# Altium project PROC010B.PrjPcb (part 1 of 5)
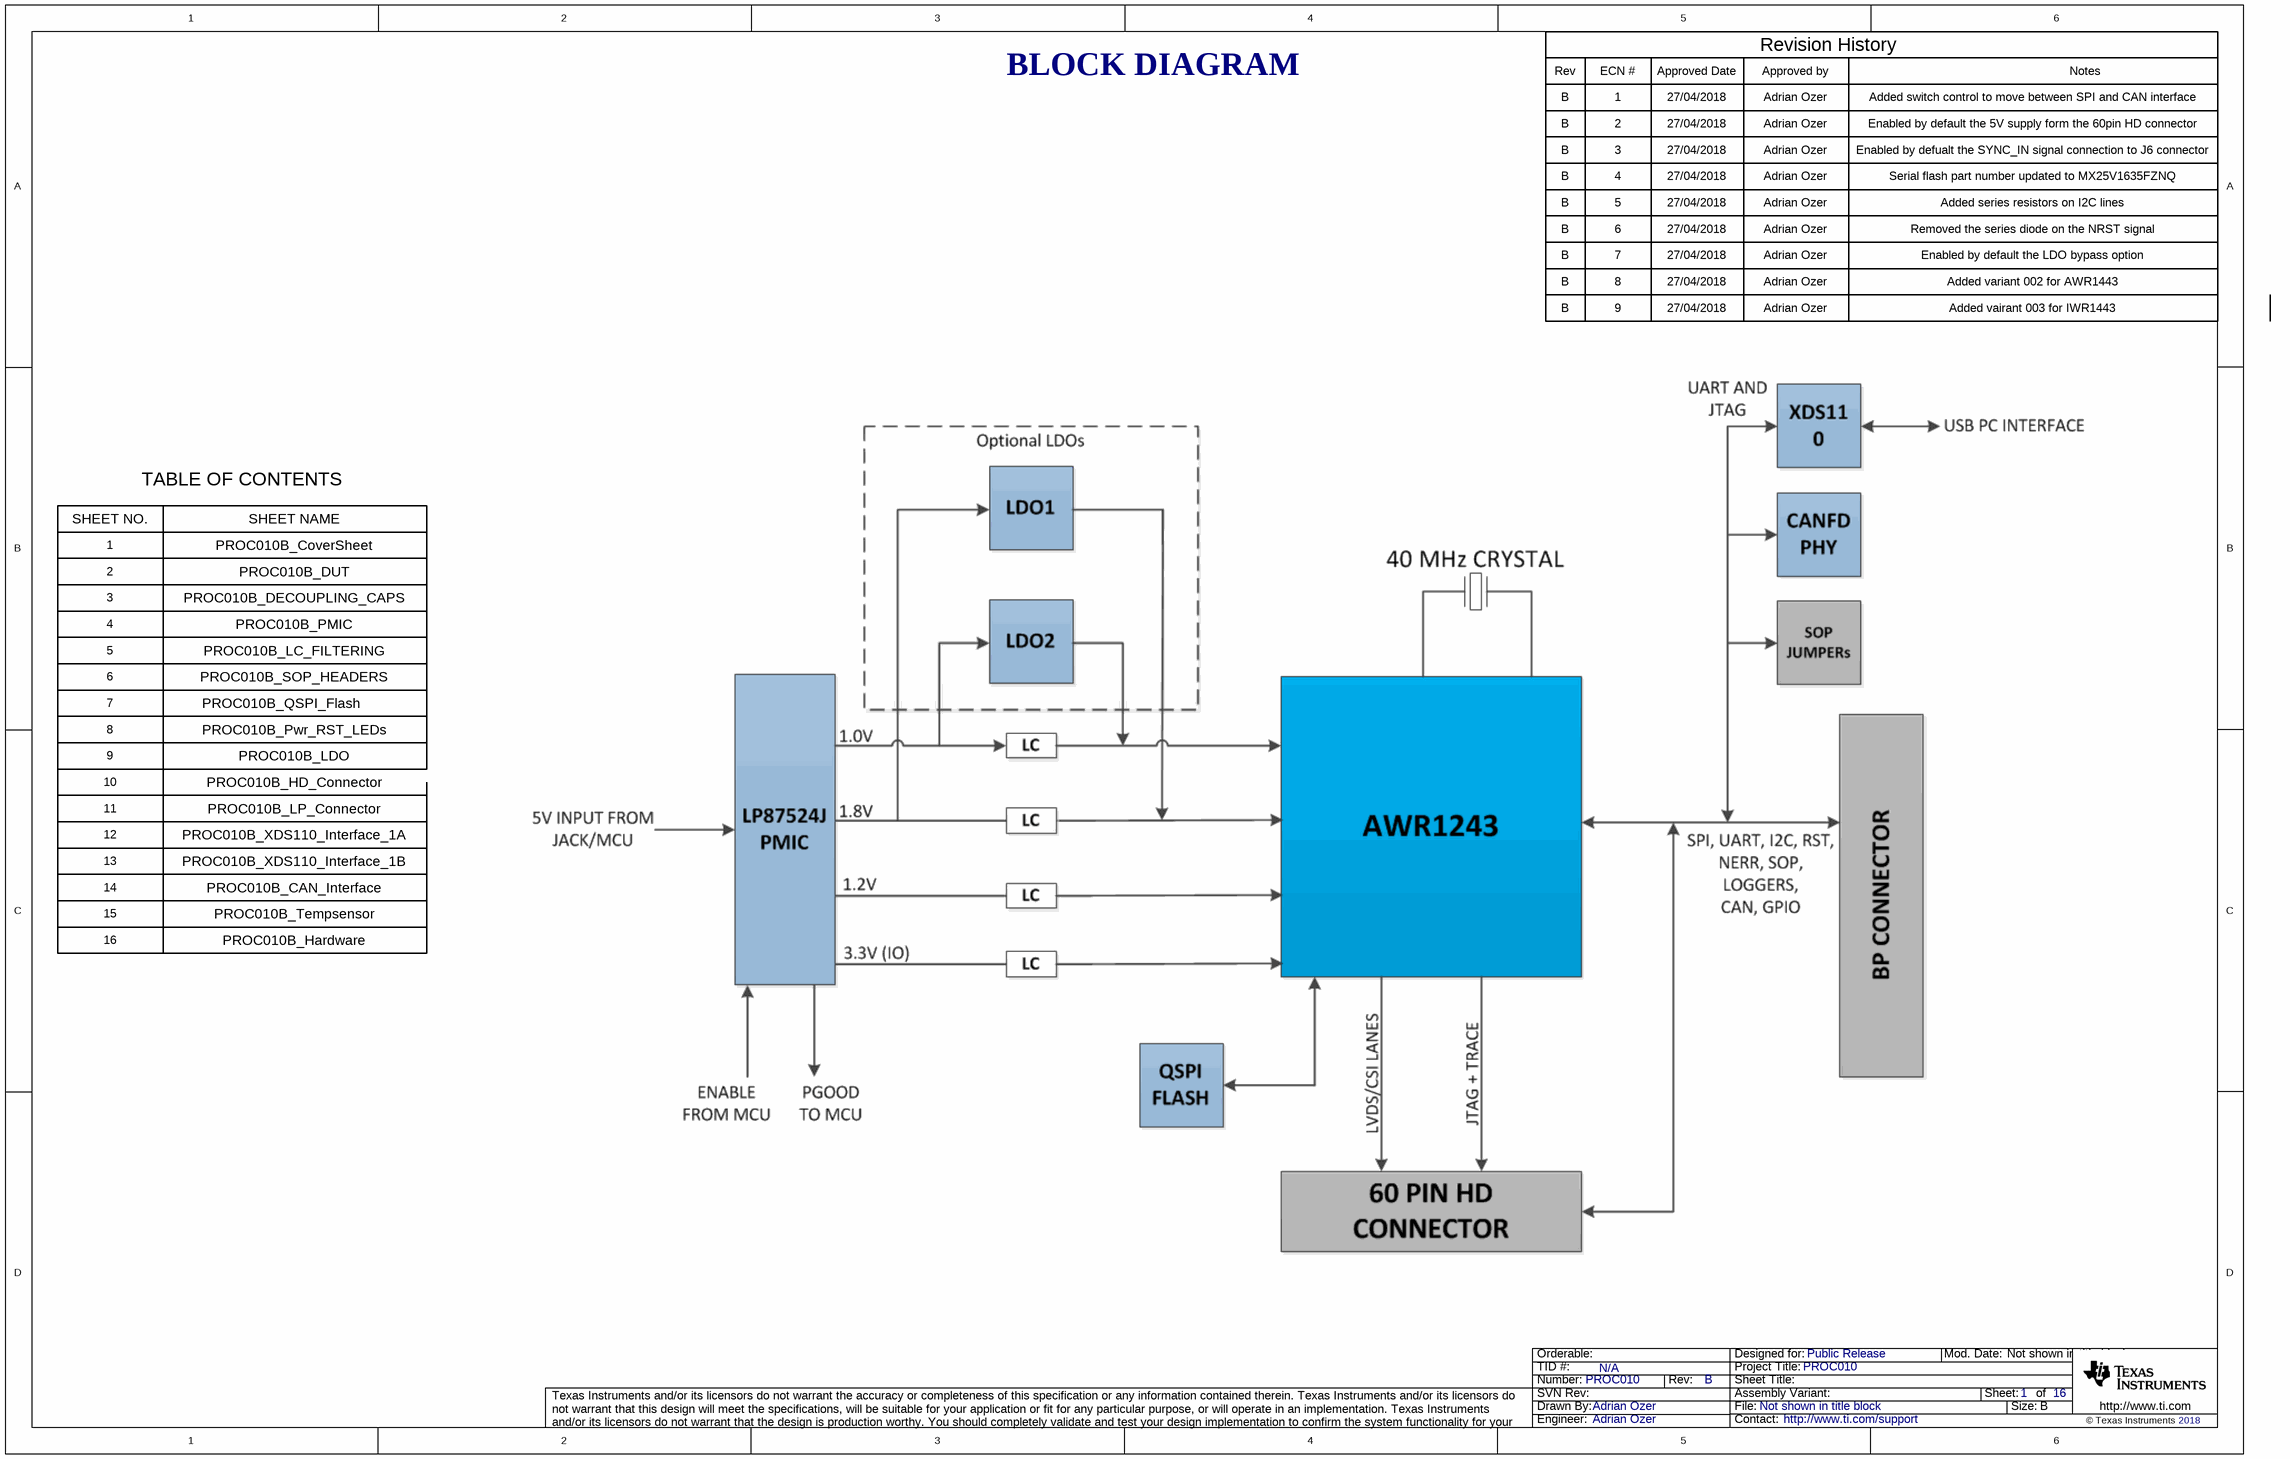
[diagram p0: PROC010B_CoverSheet.SchDoc]
CopyrightYear: 2018; PCB_Layout: Tessolve; PCB_Rev: B; PRJ_Customer: Public Release; PRJ_Engineer: Adrian Ozer; PRJ_Number: PROC010; PRJ_Title: PROC010; SCH_Rev: B; TechSupport: http://www.ti.com/support; TID: N/A
16 sheets, 385 parts. Net scope: flat (ports and power ports of the same name join across sheets).
Board file: PROC010B_PCB.PcbDoc
Sheets:
  PROC010B_CoverSheet.SchDoc
  PROC010B_DUT_Reference.SchDoc
  PROC010B_Decoupling_Caps_Reference.SchDoc
  PROC010B_PMIC_Reference.SchDoc
  PROC010B_LC_Filtering_Reference.SchDoc
  PROC010B_SOP_Headers_Reference.SchDoc
  PROC010B_QSPI_Flash_Reference.SchDoc
  PROC010B_Pwr_RST_LEDs.SchDoc
  PROC010B_LDO.SchDoc
  PROC010B_HD Connector.SchDoc
  PROC010B_LP Connector.SchDoc
  PROC010B_XDS110 Interface_1A.SchDoc
  PROC010B_XDS110 Interface_1B.SchDoc
  PROC010B_CAN Interface.SchDoc
  PROC010B_Tempsensor.SchDoc
  PROC010B_Hardware.SchDoc

## Sheet PROC010B_CoverSheet.SchDoc
size 431 x 279 mm; Date: Not shown in title block; ApprovedBy: Not shown in title block; CheckedBy: Not shown in title block; Author: Not shown in title block; CompanyName: Not shown in title block; DrawnBy: Adrian Ozer; Engineer: Not shown in title block; Organization: Not shown in title block; Address1: Not shown in title block; Address2: Not shown in title block; Address3: Not shown in title block; Address4: Not shown in title block; DocumentNumber: 1; Revision: Use project parameter SCH_Rev; SheetNumber: 1; SheetTotal: 16; PageSetup: Record=PageOptions|CenterHorizontal=True|CenterVertical=True|PrintScale=1.00|XCorrection=1.00|YCorrection=1.00|PrintKind=0|BorderSize=5000000|LeftOffset=0|BottomOffset=0|Orientation=2|PaperLength=1000|PaperWidth=1000|Scale=100|PaperSource=15|PrintQuality=600|MediaType=1|DitherType=10|PaperKind=Letter|PrintScaleMode=1; CurrentTime: Not shown in title block; CurrentDate: Not shown in title block; Time: Not shown in title block; DocumentFullPathAndName: Not shown in title block; DocumentName: Not shown in title block; ModifiedDate: Not shown in title block; ImagePath: Not shown in title block

### Notes on the sheet
- BLOCK DIAGRAM
- Rev
- B
- ECN #
- 1
- Approved Date
- 27/04/2018
- Approved by
- Adrian Ozer
- Revision History
- Added switch control to move between SPI and CAN interface
- Notes
- 2
- 3
- Enabled by default the 5V supply form the 60pin HD connector
- Enabled by defualt the SYNC_IN signal connection to J6 connector
- 4
- 5
- 6
- Serial flash part number updated to MX25V1635FZNQ
- Added series resistors on I2C lines
- Removed the series diode on the NRST signal
- 7
- 8
- Enabled by default the LDO bypass option
- Added variant 002 for AWR1443
- 9
- Added vairant 003 for IWR1443
- TABLE OF CONTENTS
- SHEET NO.
- SHEET NAME
- PROC010B_CoverSheet
- PROC010B_DUT
- PROC010B_DECOUPLING_CAPS
- PROC010B_PMIC
- PROC010B_LC_FILTERING
- PROC010B_SOP_HEADERS
- PROC010B_QSPI_Flash
- PROC010B_Pwr_RST_LEDs
- PROC010B_LDO
- 11
- 10
- PROC010B_HD_Connector
- PROC010B_LP_Connector
- 12
- 13
- 14
- PROC010B_XDS110_Interface_1A
- PROC010B_XDS110_Interface_1B
- PROC010B_CAN_Interface
- 15
- 16
- PROC010B_Tempsensor
- PROC010B_Hardware
- Drawn By:
- SVN Rev:
- Number:
- TID #:
- Orderable:
- Rev:
- Sheet Title:
- File:
- Project Title:
- Designed for:
- Assembly Variant:
- Mod. Date:
- Sheet:
- Size:
- of
- http://www.ti.com
- Texas Instruments and/or its licensors do not warrant the accuracy or completeness of this specification or any information contained therein. Texas Instruments and/or its licensors do not warrant that this design will meet the specifications, will be suitable for your application or fit for any particular purpose, or will operate in an implementation. Texas Instruments and/or its licensors do not warrant that the design is production worthy. You should completely validate and test your design implementation to confirm the system functionality for your application.
- Engineer:
- Contact:
- © Texas Instruments

## Sheet PROC010B_DUT_Reference.SchDoc
size 431 x 279 mm; Date: Not shown in title block; ApprovedBy: Not shown in title block; CheckedBy: Not shown in title block; Author: Not shown in title block; CompanyName: Not shown in title block; DrawnBy: Adrian Ozer; Engineer: Not shown in title block; Organization: Not shown in title block; Address1: Not shown in title block; Address2: Not shown in title block; Address3: Not shown in title block; Address4: Not shown in title block; DocumentNumber: 2; Revision: Use project parameter SCH_Rev; SheetNumber: 2; SheetTotal: 16; PageSetup: Record=PageOptions|CenterHorizontal=True|CenterVertical=True|PrintScale=1.00|XCorrection=1.00|YCorrection=1.00|PrintKind=0|BorderSize=5000000|LeftOffset=0|BottomOffset=0|Orientation=2|PaperLength=1000|PaperWidth=1000|Scale=100|PaperSource=15|PrintQuality=600|MediaType=1|DitherType=10|PaperKind=Letter|PrintScaleMode=1; CurrentTime: Not shown in title block; CurrentDate: Not shown in title block; Time: Not shown in title block; DocumentFullPathAndName: Not shown in title block; DocumentName: Not shown in title block; ModifiedDate: Not shown in title block; ImagePath: Not shown in title block
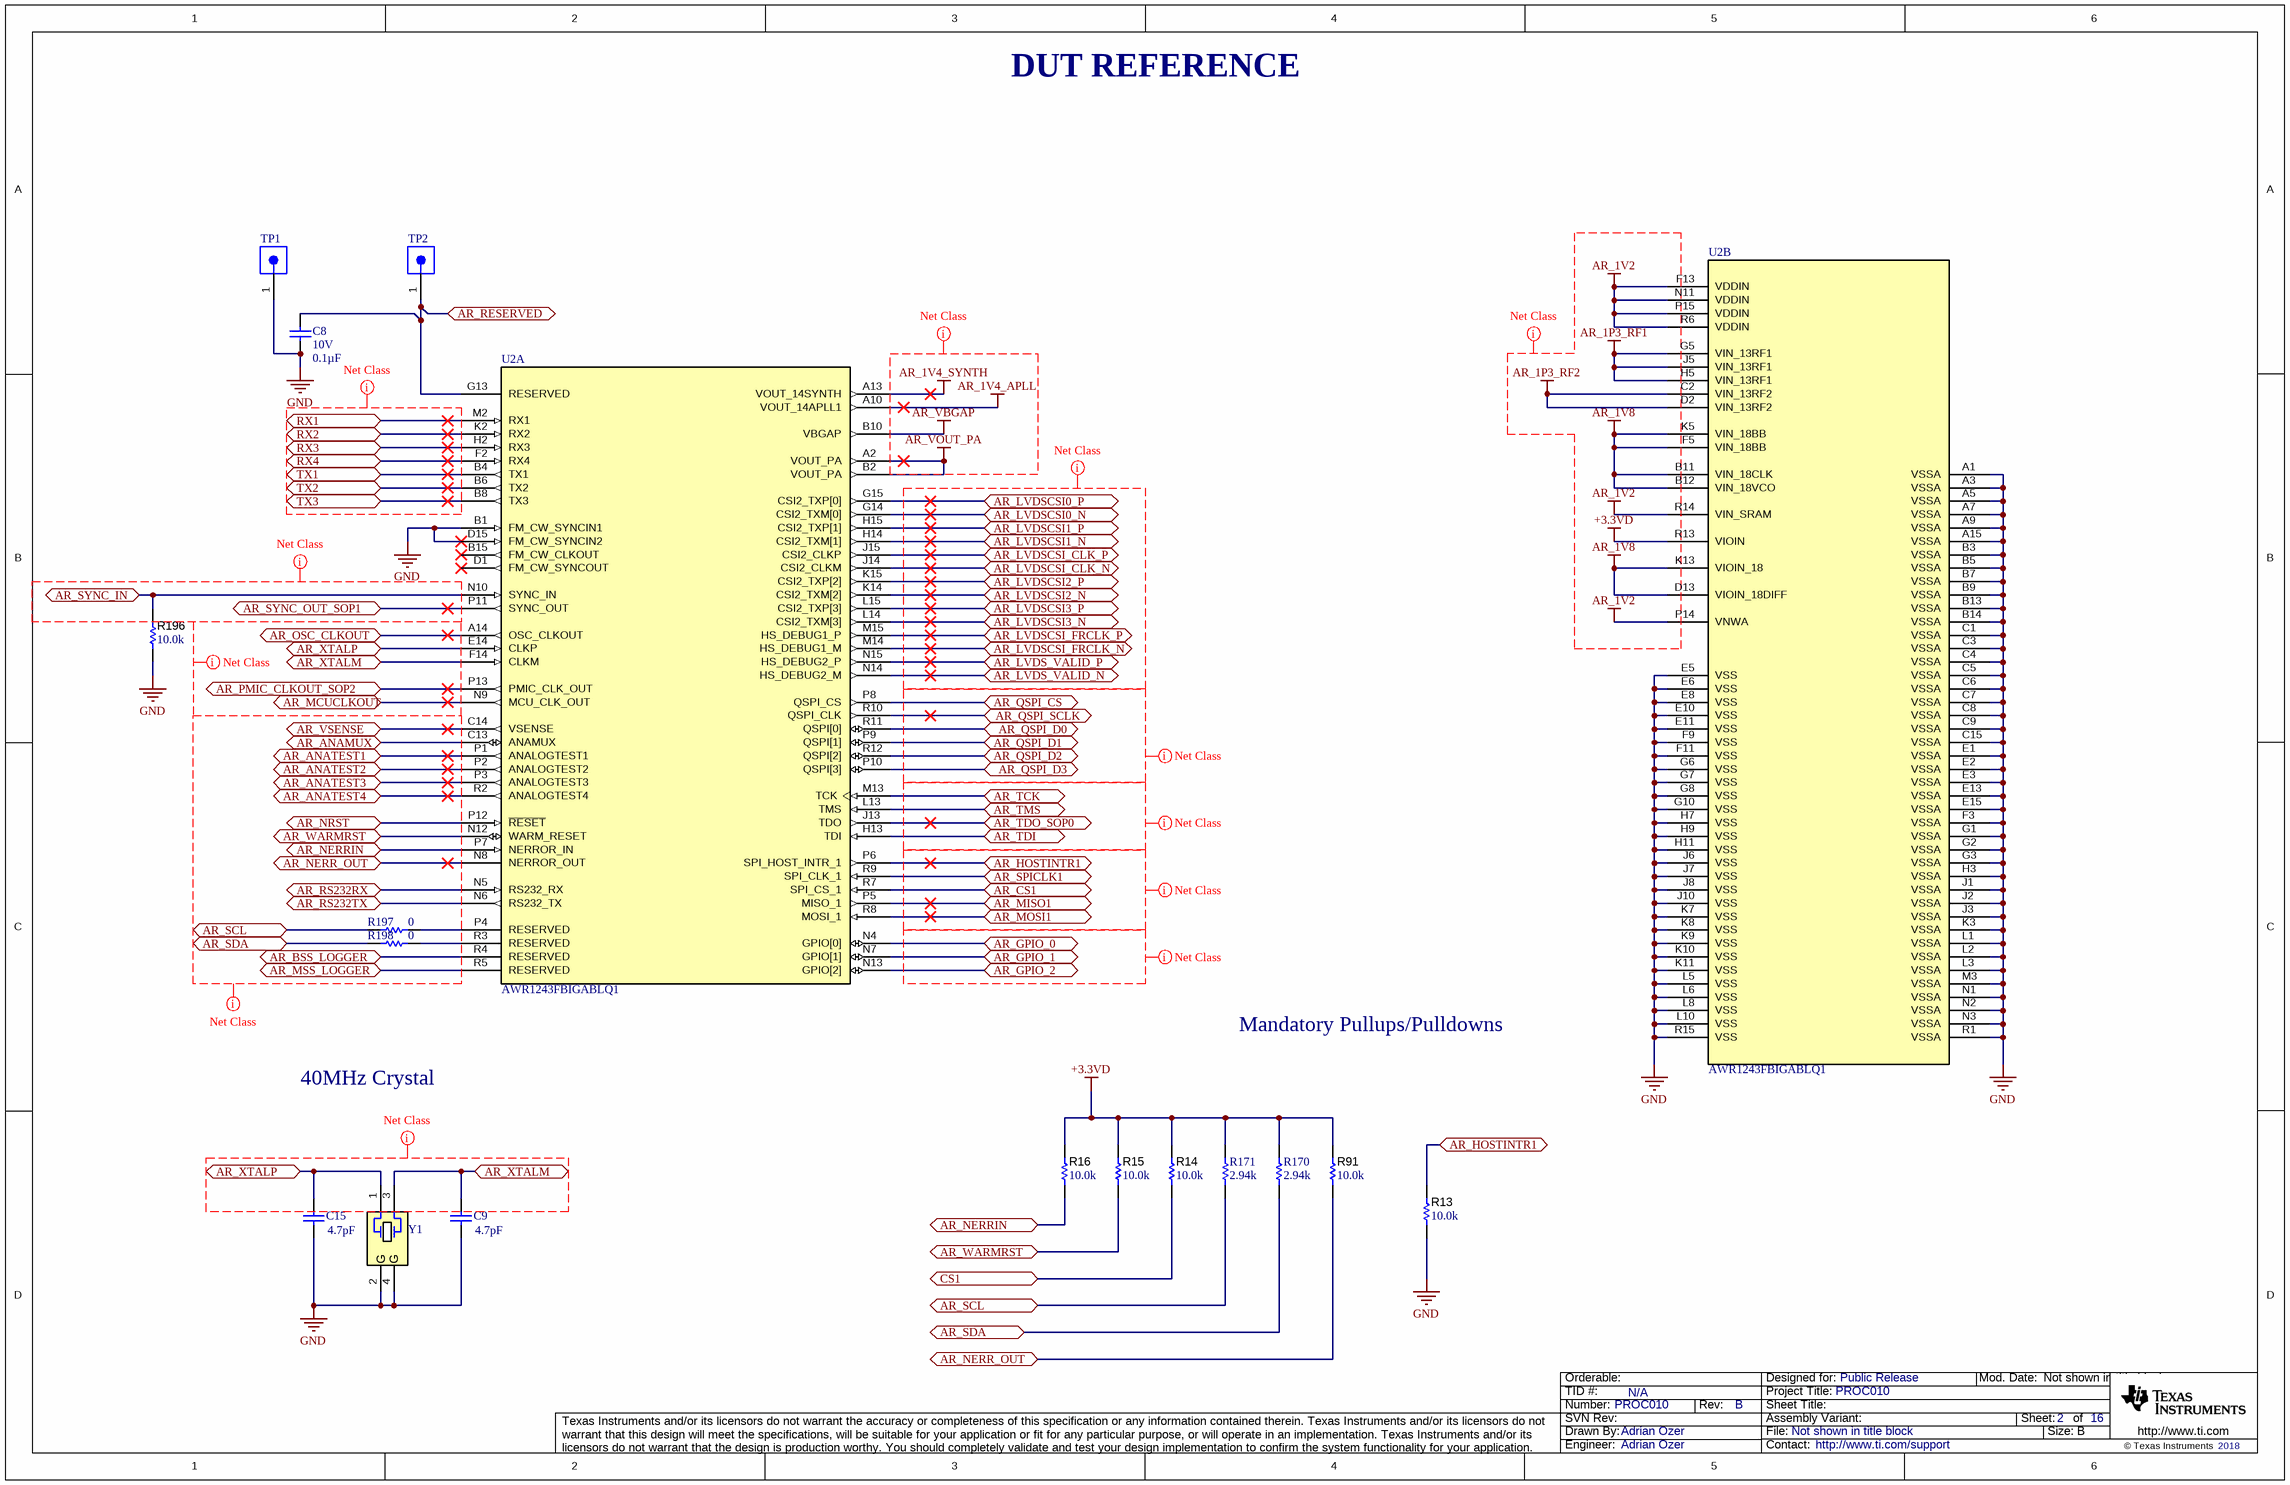
[diagram p1: PROC010B_DUT_Reference.SchDoc]

### Parts
C8  VDC_V: 10V  ValueDisplayed: 0.1µF  [0201_033]  (hidden comment: C0603X7S1A104K030BC)
C9  ValueDisplayed: 4.7pF  [0402]  (hidden comment: GJM1555C1H4R7BB01D)
C15  ValueDisplayed: 4.7pF  [0402]  (hidden comment: GJM1555C1H4R7BB01D)
R13  ValueDisplayed: 10.0k  [0402L]  (hidden comment: CRCW040210K0FKED)
R14  ValueDisplayed: 10.0k  [0402L]  (hidden comment: CRCW040210K0FKED)
R15  ValueDisplayed: 10.0k  [0402L]  (hidden comment: CRCW040210K0FKED)
R16  ValueDisplayed: 10.0k  [0402L]  (hidden comment: CRCW040210K0FKED)
R91  ValueDisplayed: 10.0k  [0402L]  (hidden comment: CRCW040210K0FKED)
R170  ValueDisplayed: 2.94k  [0402]  (hidden comment: CRCW04022K94FKED)
R171  ValueDisplayed: 2.94k  [0402]  (hidden comment: CRCW04022K94FKED)
R196  ValueDisplayed: 10.0k  [0402L]  (hidden comment: CRCW040210K0FKED)
R197  ValueDisplayed: 0  [0201]  (hidden comment: CRCW02010000Z0ED)
R198  ValueDisplayed: 0  [0201]  (hidden comment: CRCW02010000Z0ED)
TP1  TSW-101-17-T-S  [Samtec_TSW-101-17-T-S]  (value not drawn)
TP2  TSW-101-17-T-S  [Samtec_TSW-101-17-T-S]  (value not drawn)
U2  AWR1243FBIGABLQ1  [ABL0161A]  (parts A,B of 2)
Y1  CX3225SA40000D0PTWCC  [Kyocera_CX3225SA]  (value not drawn)

### Ports
AR_ANAMUX, AR_ANATEST1, AR_ANATEST2, AR_ANATEST3, AR_ANATEST4, AR_BSS_LOGGER, AR_CS1, AR_GPIO_0, AR_GPIO_1, AR_GPIO_2, AR_HOSTINTR1, AR_LVDS_VALID_N, AR_LVDS_VALID_P, AR_LVDSCSI0_N, AR_LVDSCSI0_P, AR_LVDSCSI1_N, AR_LVDSCSI1_P, AR_LVDSCSI2_N, AR_LVDSCSI2_P, AR_LVDSCSI3_N, AR_LVDSCSI3_P, AR_LVDSCSI_CLK_N, AR_LVDSCSI_CLK_P, AR_LVDSCSI_FRCLK_N, AR_LVDSCSI_FRCLK_P, AR_MCUCLKOUT, AR_MISO1, AR_MOSI1, AR_MSS_LOGGER, AR_NERR_OUT, AR_NERRIN, AR_NRST, AR_OSC_CLKOUT, AR_PMIC_CLKOUT_SOP2, AR_QSPI_CS, AR_QSPI_D0, AR_QSPI_D1, AR_QSPI_D2, AR_QSPI_D3, AR_QSPI_SCLK, AR_RESERVED, AR_RS232RX, AR_RS232TX, AR_SCL, AR_SDA, AR_SPICLK1, AR_SYNC_IN, AR_SYNC_OUT_SOP1, AR_TCK, AR_TDI, AR_TDO_SOP0, AR_TMS, AR_VSENSE, AR_WARMRST, AR_XTALM, AR_XTALP, CS1, RX1, RX2, RX3, RX4, TX1, TX2, TX3

### Nets
+3.3VD: R14.2 R15.2 R16.2 R91.2 R170.2 R171.2 U2.R13(VIOIN)
AR_1P3_RF1: U2.G5(VIN_13RF1) U2.H5(VIN_13RF1) U2.J5(VIN_13RF1)
AR_1P3_RF2: U2.C2(VIN_13RF2) U2.D2(VIN_13RF2)
AR_1V2: U2.F13(VDDIN) U2.N11(VDDIN) U2.P14(VNWA) U2.P15(VDDIN) U2.R6(VDDIN) U2.R14(VIN_SRAM)
AR_1V4_APLL: U2.A10(VOUT_14APLL1)
AR_1V4_SYNTH: U2.A13(VOUT_14SYNTH)
AR_1V8: U2.B11(VIN_18CLK) U2.B12(VIN_18VCO) U2.D13(VIOIN_18DIFF) U2.F5(VIN_18BB) U2.K5(VIN_18BB) U2.K13(VIOIN_18)
AR_VBGAP: U2.B10(VBGAP)
AR_VOUT_PA: U2.A2(VOUT_PA) U2.B2(VOUT_PA)
GND: C8.2 C9.2 C15.1 R13.1 R196.1 TP1.1 U2.A1(VSSA) U2.A3(VSSA) U2.A5(VSSA) U2.A7(VSSA) U2.A9(VSSA) U2.A15(VSSA) U2.B1(FM_CW_SYNCIN1) U2.B3(VSSA) U2.B5(VSSA) U2.B7(VSSA) U2.B9(VSSA) U2.B13(VSSA) U2.B14(VSSA) U2.C1(VSSA) U2.C3(VSSA) U2.C4(VSSA) U2.C5(VSSA) U2.C6(VSSA) U2.C7(VSSA) U2.C8(VSSA) U2.C9(VSSA) U2.C15(VSSA) U2.D15(FM_CW_SYNCIN2) U2.E1(VSSA) U2.E2(VSSA) U2.E3(VSSA) U2.E5(VSS) U2.E6(VSS) U2.E8(VSS) U2.E10(VSS) U2.E11(VSS) U2.E13(VSSA) U2.E15(VSSA) U2.F3(VSSA) U2.F9(VSS) U2.F11(VSS) U2.G1(VSSA) U2.G2(VSSA) U2.G3(VSSA) U2.G6(VSS) U2.G7(VSS) U2.G8(VSS) U2.G10(VSS) U2.H3(VSSA) U2.H7(VSS) U2.H9(VSS) U2.H11(VSS) U2.J1(VSSA) U2.J2(VSSA) U2.J3(VSSA) U2.J6(VSS) U2.J7(VSS) U2.J8(VSS) U2.J10(VSS) U2.K3(VSSA) U2.K7(VSS) U2.K8(VSS) U2.K9(VSS) U2.K10(VSS) U2.K11(VSS) U2.L1(VSSA) U2.L2(VSSA) U2.L3(VSSA) U2.L5(VSS) U2.L6(VSS) U2.L8(VSS) U2.L10(VSS) U2.M3(VSSA) U2.N1(VSSA) U2.N2(VSSA) U2.N3(VSSA) U2.R1(VSSA) U2.R15(VSS) Y1.2(GND) Y1.4(GND)
AR_ANAMUX: U2.C13(ANAMUX) ; port AR_ANAMUX
AR_ANATEST1: U2.P1(ANALOGTEST1) ; port AR_ANATEST1
AR_ANATEST2: U2.P2(ANALOGTEST2) ; port AR_ANATEST2
AR_ANATEST3: U2.P3(ANALOGTEST3) ; port AR_ANATEST3
AR_ANATEST4: U2.R2(ANALOGTEST4) ; port AR_ANATEST4
AR_BSS_LOGGER: U2.R4(RESERVED) ; port AR_BSS_LOGGER
AR_CS1: U2.R7(SPI_CS_1) ; port AR_CS1
AR_GPIO_0: U2.N4(GPIO[0]) ; port AR_GPIO_0
AR_GPIO_1: U2.N7(GPIO[1]) ; port AR_GPIO_1
AR_GPIO_2: U2.N13(GPIO[2]) ; port AR_GPIO_2
AR_HOSTINTR1: R13.2 U2.P6(SPI_HOST_INTR_1) ; port AR_HOSTINTR1
AR_LVDS_VALID_N: U2.N14(HS_DEBUG2_M) ; port AR_LVDS_VALID_N
AR_LVDS_VALID_P: U2.N15(HS_DEBUG2_P) ; port AR_LVDS_VALID_P
AR_LVDSCSI0_N: U2.G14(CSI2_TXM[0]) ; port AR_LVDSCSI0_N
AR_LVDSCSI0_P: U2.G15(CSI2_TXP[0]) ; port AR_LVDSCSI0_P
AR_LVDSCSI1_N: U2.H14(CSI2_TXM[1]) ; port AR_LVDSCSI1_N
AR_LVDSCSI1_P: U2.H15(CSI2_TXP[1]) ; port AR_LVDSCSI1_P
AR_LVDSCSI2_N: U2.K14(CSI2_TXM[2]) ; port AR_LVDSCSI2_N
AR_LVDSCSI2_P: U2.K15(CSI2_TXP[2]) ; port AR_LVDSCSI2_P
AR_LVDSCSI3_N: U2.L14(CSI2_TXM[3]) ; port AR_LVDSCSI3_N
AR_LVDSCSI3_P: U2.L15(CSI2_TXP[3]) ; port AR_LVDSCSI3_P
AR_LVDSCSI_CLK_N: U2.J14(CSI2_CLKM) ; port AR_LVDSCSI_CLK_N
AR_LVDSCSI_CLK_P: U2.J15(CSI2_CLKP) ; port AR_LVDSCSI_CLK_P
AR_LVDSCSI_FRCLK_N: U2.M14(HS_DEBUG1_M) ; port AR_LVDSCSI_FRCLK_N
AR_LVDSCSI_FRCLK_P: U2.M15(HS_DEBUG1_P) ; port AR_LVDSCSI_FRCLK_P
AR_MCUCLKOUT: U2.N9(MCU_CLK_OUT) ; port AR_MCUCLKOUT
AR_MISO1: U2.P5(MISO_1) ; port AR_MISO1
AR_MOSI1: U2.R8(MOSI_1) ; port AR_MOSI1
AR_MSS_LOGGER: U2.R5(RESERVED) ; port AR_MSS_LOGGER
AR_NERR_OUT: R91.1 U2.N8(NERROR_OUT) ; port AR_NERR_OUT
AR_NERRIN: R16.1 U2.P7(NERROR_IN) ; port AR_NERRIN
AR_NRST: U2.P12(~{RESET}) ; port AR_NRST
AR_OSC_CLKOUT: U2.A14(OSC_CLKOUT) ; port AR_OSC_CLKOUT
AR_PMIC_CLKOUT_SOP2: U2.P13(PMIC_CLK_OUT) ; port AR_PMIC_CLKOUT_SOP2
AR_QSPI_CS: U2.P8(QSPI_CS) ; port AR_QSPI_CS
AR_QSPI_D0: U2.R11(QSPI[0]) ; port AR_QSPI_D0
AR_QSPI_D1: U2.P9(QSPI[1]) ; port AR_QSPI_D1
AR_QSPI_D2: U2.R12(QSPI[2]) ; port AR_QSPI_D2
AR_QSPI_D3: U2.P10(QSPI[3]) ; port AR_QSPI_D3
AR_QSPI_SCLK: U2.R10(QSPI_CLK) ; port AR_QSPI_SCLK
AR_RESERVED: C8.1 TP2.1 U2.G13(RESERVED) ; port AR_RESERVED
AR_RS232RX: U2.N5(RS232_RX) ; port AR_RS232RX
AR_RS232TX: U2.N6(RS232_TX) ; port AR_RS232TX
AR_SCL: R171.1 R197.1 ; port AR_SCL
AR_SDA: R170.1 R198.1 ; port AR_SDA
AR_SPICLK1: U2.R9(SPI_CLK_1) ; port AR_SPICLK1
AR_SYNC_IN: R196.2 U2.N10(SYNC_IN) ; port AR_SYNC_IN
AR_SYNC_OUT_SOP1: U2.P11(SYNC_OUT) ; port AR_SYNC_OUT_SOP1
AR_TCK: U2.M13(TCK) ; port AR_TCK
AR_TDI: U2.H13(TDI) ; port AR_TDI
AR_TDO_SOP0: U2.J13(TDO) ; port AR_TDO_SOP0
AR_TMS: U2.L13(TMS) ; port AR_TMS
AR_VSENSE: U2.C14(VSENSE) ; port AR_VSENSE
AR_WARMRST: R15.1 U2.N12(WARM_RESET) ; port AR_WARMRST
AR_XTALM: C9.1 U2.F14(CLKM) Y1.3 ; port AR_XTALM
AR_XTALP: C15.2 U2.E14(CLKP) Y1.1 ; port AR_XTALP
CS1: R14.1 ; port CS1
RX1: U2.M2(RX1) ; port RX1
RX2: U2.K2(RX2) ; port RX2
RX3: U2.H2(RX3) ; port RX3
RX4: U2.F2(RX4) ; port RX4
TX1: U2.B4(TX1) ; port TX1
TX2: U2.B6(TX2) ; port TX2
TX3: U2.B8(TX3) ; port TX3
NetR197_2: R197.2 U2.P4(RESERVED)
NetR198_2: R198.2 U2.R3(RESERVED)

Not connected (* = marked no-connect by the designer): U2 B15(FM_CW_CLKOUT)* D1(FM_CW_SYNCOUT)*

### Layout directives
net class RF: (no net found under the mark)
net class GENERAL: (no net found under the mark)
net class SPI: (no net found under the mark)
net class PWR: +3.3VD, AR_1P3_RF1, AR_1P3_RF2, AR_1V2, AR_1V4_APLL, AR_1V4_SYNTH, AR_1V8, AR_VBGAP, AR_VOUT_PA
net class CLK: (no net found under the mark)
net class LVDS: (no net found under the mark)
net class QSPI: (no net found under the mark)
net class JTAG: (no net found under the mark)

### Notes on the sheet
- DUT REFERENCE
- Mandatory Pullups/Pulldowns
- 40MHz Crystal
- Drawn By:
- SVN Rev:
- Number:
- TID #:
- Orderable:
- Rev:
- Sheet Title:
- File:
- Project Title:
- Designed for:
- Assembly Variant:
- Mod. Date:
- Sheet:
- Size:
- of
- B
- http://www.ti.com
- Texas Instruments and/or its licensors do not warrant the accuracy or completeness of this specification or any information contained therein. Texas Instruments and/or its licensors do not warrant that this design will meet the specifications, will be suitable for your application or fit for any particular purpose, or will operate in an implementation. Texas Instruments and/or its licensors do not warrant that the design is production worthy. You should completely validate and test your design implementation to confirm the system functionality for your application.
- Engineer:
- Contact:
- © Texas Instruments
- (in symbol CMP-0004694-3) G

### Library data of the parts
C8 = CMP-0078219-1: CAP, CERM, 0.1 µF, 10 V,+/- 10%, X7S, 0201; Manufacturer: TDK; TaMin_C: -55°C; Polarized: N; Green_Lifecycle: NRND; SizeAreaWB_mm2: 2.08; Green_REACh: Passed; U/M: EA; Value: 0.1uF; TaMax_C: 125°C; SizeZ_mm: 0.33; SizeX_mm: 0.6; SizeY_mm: 0.3; Cap_Case: 0201; SizeArea_mm2: 0.18; Cap_F: 100nF; AEC Category: Q200; ComponentLink1URL: https://product.tdk.com/info/en/catalog/datasheets/mlcc_commercial_general_en.pdf; Supplier Part Number 2: 94Y9906; Supplier 2: Newark; Supplier Part Number 3: 810-C0603X7S1A104K; TempCo: X7S; Supplier 3: Mouser; RoHS: Y; MountType: SMT; Green_EU RoHS-2: Passed; Supplier 1: Digi-Key; Green_EU RoHS: Passed; PackageReference: 0201; Tolerance_%: 10%; Value2: 10V; CompType: Capacitor; PartNumber: C0603X7S1A104K030BC; AEC Qualified: N; ComponentLink1Description: Datasheet link; AEC Grade: N/A; Supplier Part Number 1: 445-9051-1-ND; Technology: Ceramic
C9 C15 = CMP-0006367-2: CAP, CERM, 4.7 pF, 50 V, +/- 2%, C0G/NP0, 0402; Manufacturer: MuRata; TaMin_C: -55°C; Polarized: N; SizeAreaWB_mm2: 3; Value1: Unknown; U/M: EA; Value: 4.7pF; TaMax_C: 125°C; SizeZ_mm: 0.6; SizeX_mm: 1; SizeY_mm: 0.5; Value2: 50V; CompType: Capacitor; AEC Category: Q200; Supplier Part Number 2: 81-GJM1555C1H4R7BB01; Publisher: Texas Instruments; Supplier 2: Mouser; TempCo: C0G/NP0; Published: 2008-06-19; RoHS: Y; MountType: SMT; Supplier 1: Digi-Key; PackageReference: 0402; Tolerance_%: 2%; Cap_Case: 0402; SizeArea_mm2: 0.5; LatestRevisionDate: 2017-03-09; PartNumber: GJM1555C1H4R7BB01D; AEC Qualified: N; Cap_F: 4.7pF; VDC_V: 50V; ComponentLink1Description: Datasheet link; AEC Grade: N/A; Supplier Part Number 1: 490-8102-1-ND; Technology: Ceramic; ComponentLink1URL: http://psearch.murata.com/capacitor/product/GJM1555C1H4R7BB01%23.pdf
R13-R16 R91 = CMP-0025958-3: RES, 10.0 k, 1%, 0.063 W, AEC-Q200 Grade 0, 0402; Manufacturer: Vishay-Dale; Power_W: 63mW; TempCo: 100 ppm/C; Value_Code: 10k0; Value: 10.0k; EIA_Code: E96; Res_ohm: 10k; SizeX_mm: 1; SizeY_mm: 0.5; SizeZ_mm: 0.6; Value2: 0.063W; AEC Qualified: Y; VDC_V: 50V; AEC Category: Q200; AEC Grade: 0; Supplier Part Number 2: 52K6595; Supplier 2: Newark; Supplier Part Number 3: 71-CRCW0402-10K-E3; Supplier 3: Mouser; RoHS: E; Value1: 1%; MountType: SMT; Supplier 1: Digi-Key; PackageReference: 0402; Tolerance_%: 1%; SizeArea_mm2: 0.5; CompType: Resistor; PartNumber: CRCW040210K0FKED; ComponentLink1Description: Datasheet link; Supplier Part Number 1: 541-10.0KLCT-ND; Technology: Thick Film; ComponentLink1URL: http://www.vishay.com/docs/20035/dcrcwe3.pdf
R170 R171 = CMP-0026244-2: RES, 2.94 k, 1%, 0.063 W, AEC-Q200 Grade 0, 0402; Manufacturer: Vishay-Dale; Power_W: 63mW; TempCo: 100 ppm/C; Value_Code: 2k94; Value: 2.94k; EIA_Code: E96; SizeX_mm: 1; SizeY_mm: 0.5; SizeZ_mm: 0.6; Value2: 0.063W; AEC Qualified: Y; VDC_V: 50V; AEC Category: Q200; AEC Grade: 0; ComponentLink1URL: http://www.vishay.com/docs/20035/dcrcwe3.pdf; Supplier Part Number 2: 52K6814; Supplier 2: Newark; Supplier Part Number 3: 71-CRCW0402-2.94K-E3; Supplier 3: Mouser; RoHS: E; Value1: 1%; MountType: SMT; Supplier 1: Digi-Key; PackageReference: 0402; Tolerance_%: 1%; Res_ohm: 2.94k; SizeArea_mm2: 0.5; CompType: Resistor; PartNumber: CRCW04022K94FKED; ComponentLink1Description: Datasheet link; Supplier Part Number 1: 541-2.94KLCT-ND; Technology: Thick Film
R196 = CMP-0025958-3: RES, 10.0 k, 1%, 0.063 W, AEC-Q200 Grade 0, 0402; Manufacturer: Vishay-Dale; Power_W: 63mW; TempCo: 100 ppm/C; Value_Code: 10k0; Value: 10.0k; EIA_Code: E96; Res_ohm: 10k; SizeX_mm: 1; SizeY_mm: 0.5; SizeZ_mm: 0.6; Value2: 0.063W; CompType: Resistor; AEC Qualified: Y; VDC_V: 50V; AEC Category: Q200; AEC Grade: 0; Supplier Part Number 2: 52K6595; Supplier 2: Newark; Supplier Part Number 3: 71-CRCW0402-10K-E3; Supplier 3: Mouser; RoHS: E; Value1: 1%; MountType: SMT; Supplier 1: Digi-Key; PackageReference: 0402; Tolerance_%: 1%; SizeArea_mm2: 0.5; PartNumber: CRCW040210K0FKED; ComponentLink1Description: Datasheet link; Supplier Part Number 1: 541-10.0KLCT-ND; Technology: Thick Film; ComponentLink1URL: http://www.vishay.com/docs/20035/dcrcwe3.pdf
R197 R198 = CMP-0027008-4: RES, 0, 5%, 0.05 W, 0201; Manufacturer: Vishay-Dale; Power_W: 50mW; TempCo: ppm/C; Value_Code: 0000; Value: 0; EIA_Code: E24; SizeX_mm: 0.6; SizeY_mm: 0.3; SizeZ_mm: 0.26; Value2: 0.05W; SizeArea_mm2: 0.18; AEC Qualified: N; AEC Category: Q200; RoHS: E; Value1: 5%; MountType: SMT; Supplier 1: Newark; PackageReference: 0201; Tolerance_%: 5%; Res_ohm: 0; CompType: Resistor; PartNumber: CRCW02010000Z0ED; ComponentLink1Description: Datasheet link; AEC Grade: N/A; Supplier Part Number 1: 72M6743; Technology: Thick Film; ComponentLink1URL: http://www.vishay.com/docs/20052/crcw0201e3.pdf
TP1 TP2 = CMP-0055993-1: Header, 100mil, 1x1, Tin, TH; Manufacturer: Samtec; Cert_VDE: N; CNHeader: FALSE; Current_A: 6.3A; Green_Lifecycle: Active; Gender: Male; Cert_CSA: Y; Green_REACh: Passed; Voltage_V: 550V; Row_Count: 1; Pitch_mm: 2.54; ComponentLink1URL: http://www.samtec.com/documents/webfiles/cpdf/TSW-XXX-XX-XXX-X-XX-XXX-MKT.pdf; Supplier Part Number 2: 12P1227; Publisher: Texas Instruments; Supplier 2: Newark; Shrouded: N; Supplier Part Number 3: 2038061; Color: Black; Supplier 3: Farnell; Cert_CULUS: N; RoHS: Y; MountType: TH; Green_EU RoHS-2: Passed; Supplier 1: Digi-Key; Green_EU RoHS: Passed; PackageReference: 2.54mm Header; PinCount: 1; CompType: Header; LatestRevisionDate: 26/05/2017; PartNumber: TSW-101-17-T-S; Orientation: Vertical; ComponentLink1Description: Datasheet URL; Supplier Part Number 1: SAM1067-01-ND; ContactFinish: Tin; CT: FALSE; Cert_UL: Y
U2 = CMP-0081285-1: Single Chip 77 and 79 GHz FMCW Transceiver, ABL0161A (FCBGA-161); Alternate PartNumber: AWR1243FBIGABLRQ1; Alternate Manufacturer: Texas Instruments; SizeAreaWB_mm2: 153.76; SizeZ_mm: 1.17; SizeX_mm: 10.4; SizeArea_mm2: 108.16; CompType: IC; AEC Qualified: N; AEC Category: Q200; ComponentLink1URL: http://www.ti.com/lit/ds/symlink/awr1243.pdf; PackageDescription: FCBGA-161; MountType: SMT; ComponentLink2URL: http://www.ti.com/product/awr1243; ComponentLink3Description: Online Datasheet; ComponentLink2Description: Product Folder; Manufacturer: Texas Instruments; ComponentLink3URL: http://www.ti.com/product/awr1243/datasheet; PackageReference: ABL0161A; SizeY_mm: 10.4; PartNumber: AWR1243FBIGABLQ1; ComponentLink1Description: Datasheet Link; PartId: 1
Y1 = CMP-0004694-3: Crystal, 40 MHz, 8pF, SMD; Manufacturer: Kyocera; TaMin_C: -40°C; Frequency Stability: +/-200ppm; SizeAreaWB_mm2: 14.7; Frequency_Fixed: 40MHz; TaMax_C: 125°C; SizeZ_mm: 0.8; SizeX_mm: 2.5; SizeY_mm: 3.2; SizeArea_mm2: 8; RoHS: Y; MountType: SMT; Supplier 1: Mouser; PackageReference: 3.2x2.5mm; CompType: Crystal; PartNumber: CX3225SA40000D0PTWCC; ComponentLink1Description: Datasheet Link; Supplier Part Number 1: 581-CX3225SA40D0PTWC; ComponentLink1URL: http://www.kyocera-crystal.jp/eng/wp-content/uploads/2016/10/cx3225sa_e.pdf

## Sheet PROC010B_Decoupling_Caps_Reference.SchDoc
size 431 x 279 mm; Date: Not shown in title block; ApprovedBy: Not shown in title block; CheckedBy: Not shown in title block; Author: Not shown in title block; CompanyName: Not shown in title block; DrawnBy: Adrian Ozer; Engineer: Not shown in title block; Organization: Not shown in title block; Address1: Not shown in title block; Address2: Not shown in title block; Address3: Not shown in title block; Address4: Not shown in title block; DocumentNumber: 3; Revision: Use project parameter SCH_Rev; SheetNumber: 3; SheetTotal: 16; PageSetup: Record=PageOptions|CenterHorizontal=True|CenterVertical=True|PrintScale=1.00|XCorrection=1.00|YCorrection=1.00|PrintKind=0|BorderSize=5000000|LeftOffset=0|BottomOffset=0|Orientation=2|PaperLength=1000|PaperWidth=1000|Scale=100|PaperSource=15|PrintQuality=600|MediaType=1|DitherType=10|PaperKind=Letter|PrintScaleMode=1; CurrentTime: Not shown in title block; CurrentDate: Not shown in title block; Time: Not shown in title block; DocumentFullPathAndName: Not shown in title block; DocumentName: Not shown in title block; ModifiedDate: Not shown in title block; ImagePath: Not shown in title block
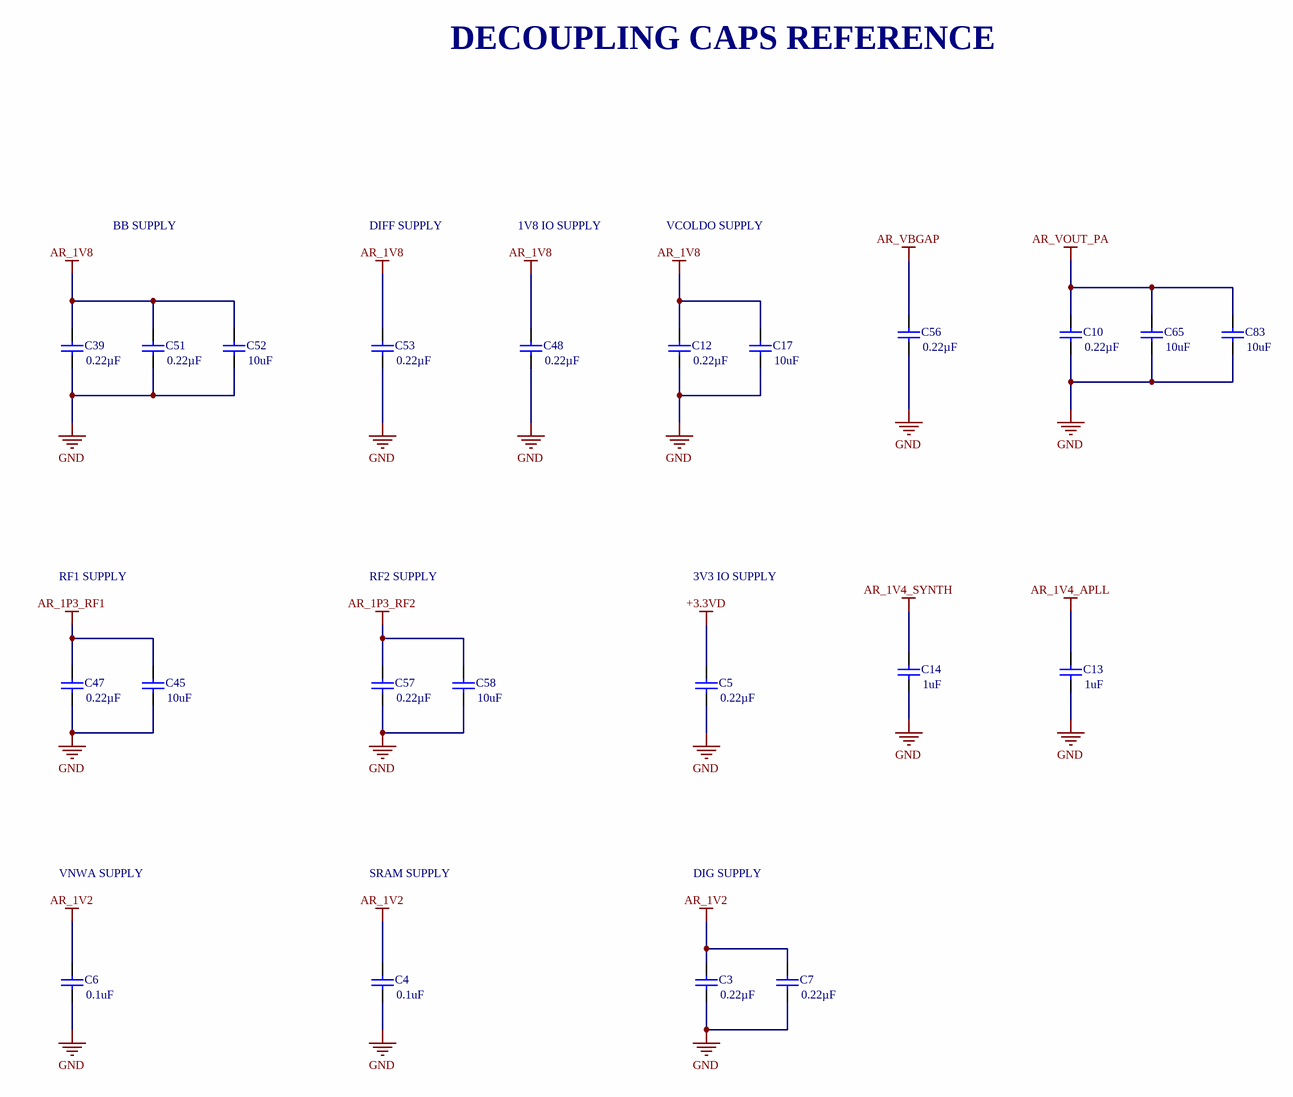
[diagram p2: PROC010B_Decoupling_Caps_Reference.SchDoc]

### Parts
C3  ValueDisplayed: 0.22µF  [0402L]  (hidden comment: GCM155R71C224KE02D)
C4  ValueDisplayed: 0.1uF  [0402L]  (hidden comment: GCM155R71C104KA55D)
C5  ValueDisplayed: 0.22µF  [0402L]  (hidden comment: GCM155R71C224KE02D)
C6  ValueDisplayed: 0.1uF  [0402]  (hidden comment: GCM155R71C104KA55D)
C7  ValueDisplayed: 0.22µF  [0402L]  (hidden comment: GCM155R71C224KE02D)
C10  ValueDisplayed: 0.22µF  [0402]  (hidden comment: GCM155R71C224KE02D)
C12  ValueDisplayed: 0.22µF  [0402]  (hidden comment: GCM155R71C224KE02D)
C13  ValueDisplayed: 1uF  [0603]  (hidden comment: GCM188R71C105KA64D)
C14  ValueDisplayed: 1uF  [0603]  (hidden comment: GCM188R71C105KA64D)
C17  ValueDisplayed: 10uF  [0805_HV]  (hidden comment: GCM21BR71A106KE22L)
C39  ValueDisplayed: 0.22µF  [0402L]  (hidden comment: GCM155R71C224KE02D)
C45  ValueDisplayed: 10uF  [0805_HV1]  (hidden comment: GCM21BR71A106KE22L)
C47  ValueDisplayed: 0.22µF  [0402L]  (hidden comment: GCM155R71C224KE02D)
C48  ValueDisplayed: 0.22µF  [0402]  (hidden comment: GCM155R71C224KE02D)
C51  ValueDisplayed: 0.22µF  [0402]  (hidden comment: GCM155R71C224KE02D)
C52  ValueDisplayed: 10uF  [0805_HV]  (hidden comment: GCM21BR71A106KE22L)
C53  ValueDisplayed: 0.22µF  [0402]  (hidden comment: GCM155R71C224KE02D)
C56  ValueDisplayed: 0.22µF  [0402]  (hidden comment: GCM155R71C224KE02D)
C57  ValueDisplayed: 0.22µF  [0402]  (hidden comment: GCM155R71C224KE02D)
C58  ValueDisplayed: 10uF  [0805]  (hidden comment: GCM21BR71A106KE22L)
C65  ValueDisplayed: 10uF  [0805_HV]  (hidden comment: GCM21BR71A106KE22L)
C83  ValueDisplayed: 10uF  [0805_HV]  (hidden comment: GCM21BR71A106KE22L)

### Nets
+3.3VD: C5.1
AR_1P3_RF1: C45.1 C47.1
AR_1P3_RF2: C57.1 C58.1
AR_1V2: C3.1 C4.1 C6.1 C7.1
AR_1V4_APLL: C13.1
AR_1V4_SYNTH: C14.1
AR_1V8: C12.1 C17.1 C39.1 C48.1 C51.1 C52.1 C53.1
AR_VBGAP: C56.1
AR_VOUT_PA: C10.1 C65.1 C83.1
GND: C3.2 C4.2 C5.2 C6.2 C7.2 C10.2 C12.2 C13.2 C14.2 C17.2 C39.2 C45.2 C47.2 C48.2 C51.2 C52.2 C53.2 C56.2 C57.2 C58.2 C65.2 C83.2

### Notes on the sheet
- DECOUPLING CAPS REFERENCE
- BB SUPPLY
- DIFF SUPPLY
- 1V8 IO SUPPLY
- VCOLDO SUPPLY
- RF1 SUPPLY
- RF2 SUPPLY
- 3V3 IO SUPPLY
- VNWA SUPPLY
- SRAM SUPPLY
- DIG SUPPLY
- Drawn By:
- SVN Rev:
- Number:
- TID #:
- Orderable:
- Rev:
- Sheet Title:
- File:
- Project Title:
- Designed for:
- Assembly Variant:
- Mod. Date:
- Sheet:
- Size:
- of
- B
- http://www.ti.com
- Texas Instruments and/or its licensors do not warrant the accuracy or completeness of this specification or any information contained therein. Texas Instruments and/or its licensors do not warrant that this design will meet the specifications, will be suitable for your application or fit for any particular purpose, or will operate in an implementation. Texas Instruments and/or its licensors do not warrant that the design is production worthy. You should completely validate and test your design implementation to confirm the system functionality for your application.
- Engineer:
- Contact:
- © Texas Instruments

### Library data of the parts
C3 C5 C7 C39 C47 = CMP-0078265-1: CAP, CERM, 0.22 µF, 16 V,+/- 10%, X7R, AEC-Q200 Grade 1, 0402; Manufacturer: MuRata; TaMin_C: -55°C; Polarized: N; SizeAreaWB_mm2: 3; U/M: EA; Value: 0.22uF; TaMax_C: 125°C; SizeZ_mm: 0.6; SizeX_mm: 1; SizeY_mm: 0.5; Cap_Case: 0402; Value2: 16V; CompType: Capacitor; AEC Qualified: Y; Cap_F: 220nF; AEC Category: Q200; ComponentLink1URL: http://psearch.en.murata.com/capacitor/product/GCM155R71C224KE02%23.pdf; Supplier Part Number 2: 81-GCM155R71C224KE2D; Supplier 2: Mouser; TempCo: X7R; RoHS: Y; MountType: SMT; Supplier 1: Digi-Key; PackageReference: 0402; Tolerance_%: 10%; SizeArea_mm2: 0.5; PartNumber: GCM155R71C224KE02D; VDC_V: 16V; ComponentLink1Description: Datasheet link; AEC Grade: 1; Supplier Part Number 1: 490-10671-1-ND; Technology: Ceramic
C4 = CMP-0006351-2: CAP, CERM, 0.1 uF, 16 V, +/- 10%, X7R, 0402; Manufacturer: MuRata; TaMin_C: -55°C; Polarized: N; SizeAreaWB_mm2: 3; Value1: Unknown; U/M: EA; Value: 0.1uF; TaMax_C: 125°C; SizeZ_mm: 0.6; SizeX_mm: 1; SizeY_mm: 0.5; Cap_Case: 0402; Value2: 16V; CompType: Capacitor; Cap_F: 100nF; AEC Category: Q200; Publisher: Texas Instruments; TempCo: X7R; Published: 2008-06-19; RoHS: Y; MountType: SMT; Supplier 1: Digi-Key; PackageReference: 0402; Tolerance_%: 10%; SizeArea_mm2: 0.5; LatestRevisionDate: 2017-03-09; PartNumber: GCM155R71C104KA55D; AEC Qualified: ?; VDC_V: 16V; ComponentLink1Description: Datasheet link; Supplier Part Number 1: 490-4759-2-ND; Technology: Ceramic; ComponentLink1URL: http://psearch.murata.com/capacitor/product/GCM155R71C104KA55%23.pdf
C6 = CMP-0006351-2: CAP, CERM, 0.1 uF, 16 V, +/- 10%, X7R, 0402; Manufacturer: MuRata; TaMin_C: -55°C; Polarized: N; SizeAreaWB_mm2: 3; Value1: Unknown; U/M: EA; Value: 0.1uF; TaMax_C: 125°C; SizeZ_mm: 0.6; SizeX_mm: 1; SizeY_mm: 0.5; Value2: 16V; Cap_F: 100nF; AEC Category: Q200; Publisher: Texas Instruments; TempCo: X7R; Published: 2008-06-19; RoHS: Y; MountType: SMT; Supplier 1: Digi-Key; PackageReference: 0402; Tolerance_%: 10%; Cap_Case: 0402; SizeArea_mm2: 0.5; CompType: Capacitor; LatestRevisionDate: 2017-03-09; PartNumber: GCM155R71C104KA55D; AEC Qualified: ?; VDC_V: 16V; ComponentLink1Description: Datasheet link; Supplier Part Number 1: 490-4759-2-ND; Technology: Ceramic; ComponentLink1URL: http://psearch.murata.com/capacitor/product/GCM155R71C104KA55%23.pdf
C10 C12 C48 C51 C53 C56 C57 = CMP-0078265-1: CAP, CERM, 0.22 µF, 16 V,+/- 10%, X7R, AEC-Q200 Grade 1, 0402; Manufacturer: MuRata; TaMin_C: -55°C; Polarized: N; SizeAreaWB_mm2: 3; U/M: EA; Value: 0.22uF; TaMax_C: 125°C; SizeZ_mm: 0.6; SizeX_mm: 1; SizeY_mm: 0.5; Value2: 16V; AEC Qualified: Y; Cap_F: 220nF; AEC Category: Q200; ComponentLink1URL: http://psearch.en.murata.com/capacitor/product/GCM155R71C224KE02%23.pdf; Supplier Part Number 2: 81-GCM155R71C224KE2D; Supplier 2: Mouser; TempCo: X7R; RoHS: Y; MountType: SMT; Supplier 1: Digi-Key; PackageReference: 0402; Tolerance_%: 10%; Cap_Case: 0402; SizeArea_mm2: 0.5; CompType: Capacitor; PartNumber: GCM155R71C224KE02D; VDC_V: 16V; ComponentLink1Description: Datasheet link; AEC Grade: 1; Supplier Part Number 1: 490-10671-1-ND; Technology: Ceramic
C13 C14 = CMP-0007136-5: CAP, CERM, 1 uF, 16 V, +/- 10%, X7R, AEC-Q200 Grade 1, 0603; Manufacturer: MuRata; TaMin_C: -55°C; Polarized: N; SizeAreaWB_mm2: 4.68; Value1: Unknown; U/M: EA; Value: 1uF; TaMax_C: 125°C; SizeZ_mm: 1; SizeX_mm: 1.6; SizeY_mm: 0.8; Value2: 16V; SizeArea_mm2: 1.28; AEC Qualified: Y; Cap_F: 1µF; AEC Category: Q200; Supplier Part Number 2: 81-GCM188R71C105K64D; Publisher: Texas Instruments; Supplier 2: Mouser; TempCo: X7R; Published: 2008-06-19; RoHS: Y; MountType: SMT; Supplier 1: Digi-Key; PackageReference: 0603; Tolerance_%: 10%; Cap_Case: 0603; CompType: Capacitor; LatestRevisionDate: 2017-03-09; PartNumber: GCM188R71C105KA64D; VDC_V: 16V; ComponentLink1Description: Datasheet link; AEC Grade: 1; Supplier Part Number 1: 490-5241-6-ND; Technology: Ceramic; ComponentLink1URL: http://psearch.en.murata.com/capacitor/product/GCM188R71C105KA64%23.pdf
C17 C52 C65 C83 = CMP-0008017-2: CAP, CERM, 10 uF, 10 V, +/- 10%, X7R, 0805; Manufacturer: MuRata; TaMin_C: -55°C; Polarized: N; SizeAreaWB_mm2: 6.75; Value1: Unknown; U/M: EA; Value: 10uF; TaMax_C: 125°C; SizeZ_mm: 1.45; SizeX_mm: 2; SizeY_mm: 1.25; Cap_Case: 0805; Value2: 10V; SizeArea_mm2: 2.5; Cap_F: 10µF; AEC Category: Q200; Supplier Part Number 2: 06AC6014; Publisher: Texas Instruments; Supplier 2: Newark; Supplier Part Number 3: 81-GCM21BR71A106KE2L; TempCo: X7R; Supplier 3: Mouser; Published: 2008-06-19; RoHS: Y; MountType: SMT; Supplier 1: Digi-Key; PackageReference: 0805; Tolerance_%: 10%; CompType: Capacitor; LatestRevisionDate: 2017-03-09; PartNumber: GCM21BR71A106KE22L; AEC Qualified: ?; VDC_V: 10V; ComponentLink1Description: Datasheet link; Supplier Part Number 1: 490-10674-1-ND; Technology: Ceramic; ComponentLink1URL: http://www.murata.com/products/catalog/pdf/c03e.pdf
C45 = CMP-0008017-2: CAP, CERM, 10 uF, 10 V, +/- 10%, X7R, 0805; Manufacturer: MuRata; TaMin_C: -55°C; Polarized: N; SizeAreaWB_mm2: 6.75; Value1: Unknown; U/M: EA; Value: 10uF; TaMax_C: 125°C; SizeZ_mm: 1.45; SizeX_mm: 2; SizeY_mm: 1.25; Cap_Case: 0805; Value2: 10V; SizeArea_mm2: 2.5; CompType: Capacitor; Cap_F: 10µF; AEC Category: Q200; Supplier Part Number 2: 06AC6014; Publisher: Texas Instruments; Supplier 2: Newark; Supplier Part Number 3: 81-GCM21BR71A106KE2L; TempCo: X7R; Supplier 3: Mouser; Published: 2008-06-19; RoHS: Y; MountType: SMT; Supplier 1: Digi-Key; PackageReference: 0805; Tolerance_%: 10%; LatestRevisionDate: 2017-03-09; PartNumber: GCM21BR71A106KE22L; AEC Qualified: ?; VDC_V: 10V; ComponentLink1Description: Datasheet link; Supplier Part Number 1: 490-10674-1-ND; Technology: Ceramic; ComponentLink1URL: http://www.murata.com/products/catalog/pdf/c03e.pdf
C58 = CMP-0008017-2: CAP, CERM, 10 uF, 10 V, +/- 10%, X7R, 0805; Manufacturer: MuRata; TaMin_C: -55°C; Polarized: N; SizeAreaWB_mm2: 6.75; Value1: Unknown; U/M: EA; Value: 10uF; TaMax_C: 125°C; SizeZ_mm: 1.45; SizeX_mm: 2; SizeY_mm: 1.25; Value2: 10V; SizeArea_mm2: 2.5; CompType: Capacitor; Cap_F: 10µF; AEC Category: Q200; Supplier Part Number 2: 06AC6014; Publisher: Texas Instruments; Supplier 2: Newark; Supplier Part Number 3: 81-GCM21BR71A106KE2L; TempCo: X7R; Supplier 3: Mouser; Published: 2008-06-19; RoHS: Y; MountType: SMT; Supplier 1: Digi-Key; PackageReference: 0805; Tolerance_%: 10%; Cap_Case: 0805; LatestRevisionDate: 2017-03-09; PartNumber: GCM21BR71A106KE22L; AEC Qualified: ?; VDC_V: 10V; ComponentLink1Description: Datasheet link; Supplier Part Number 1: 490-10674-1-ND; Technology: Ceramic; ComponentLink1URL: http://www.murata.com/products/catalog/pdf/c03e.pdf

## Sheet PROC010B_PMIC_Reference.SchDoc: PMIC
size 431 x 279 mm; Date: Not shown in title block; ApprovedBy: Not shown in title block; CheckedBy: Not shown in title block; Author: Not shown in title block; CompanyName: Not shown in title block; DrawnBy: Adrian Ozer; Engineer: Not shown in title block; Organization: Not shown in title block; Address1: Not shown in title block; Address2: Not shown in title block; Address3: Not shown in title block; Address4: Not shown in title block; DocumentNumber: 4; Revision: Use project parameter SCH_Rev; SheetNumber: 4; SheetTotal: 16; PageSetup: Record=PageOptions|CenterHorizontal=True|CenterVertical=True|PrintScale=1.00|XCorrection=1.00|YCorrection=1.00|PrintKind=0|BorderSize=5000000|LeftOffset=0|BottomOffset=0|Orientation=2|PaperLength=1000|PaperWidth=1000|Scale=100|PaperSource=15|PrintQuality=600|MediaType=1|DitherType=10|PaperKind=Letter|PrintScaleMode=1; CurrentTime: Not shown in title block; CurrentDate: Not shown in title block; Time: Not shown in title block; DocumentFullPathAndName: Not shown in title block; DocumentName: Not shown in title block; ModifiedDate: Not shown in title block; ImagePath: Not shown in title block
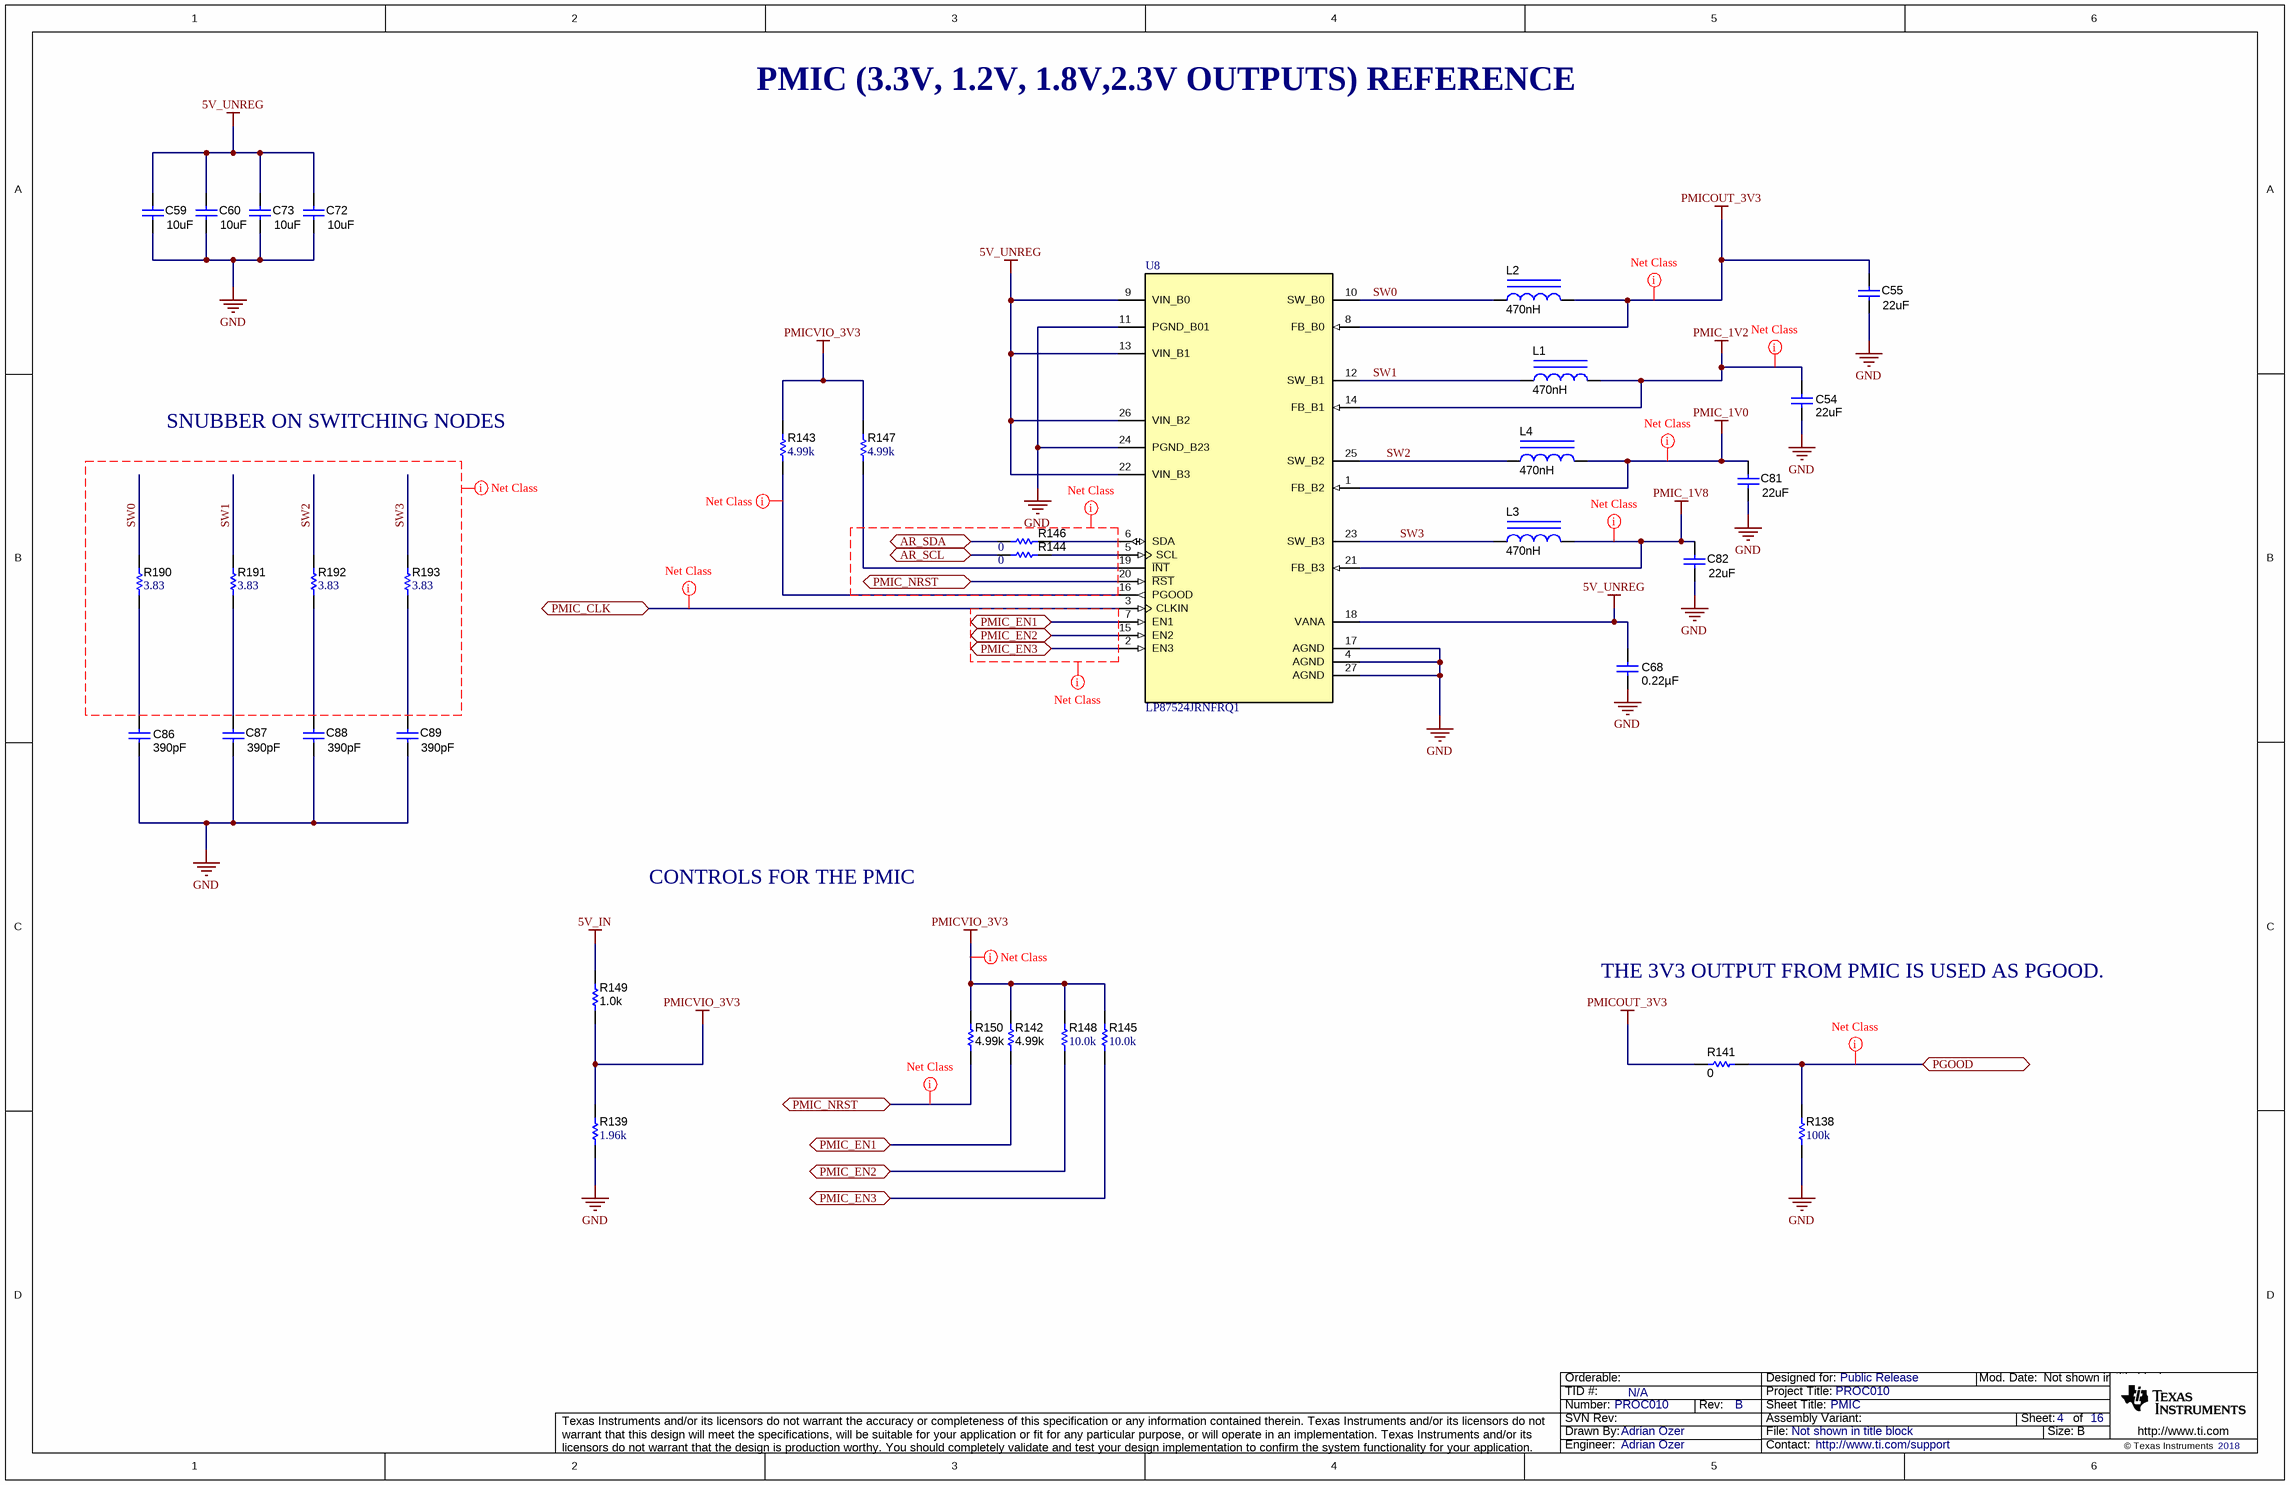
[diagram p3: PROC010B_PMIC_Reference.SchDoc]

### Parts
C54  ValueDisplayed: 22uF  [1206_180]  (hidden comment: GCM31CR71A226KE02)
C55  ValueDisplayed: 22uF  [1206_180]  (hidden comment: GCM31CR71A226KE02)
C59  ValueDisplayed: 10uF  [0805_HV1]  (hidden comment: GCM21BR71A106KE22L)
C60  ValueDisplayed: 10uF  [0805_HV1]  (hidden comment: GCM21BR71A106KE22L)
C68  ValueDisplayed: 0.22µF  [0402L]  (hidden comment: GCM155R71C224KE02D)
C72  ValueDisplayed: 10uF  [0805_HV1]  (hidden comment: GCM21BR71A106KE22L)
C73  ValueDisplayed: 10uF  [0805_HV1]  (hidden comment: GCM21BR71A106KE22L)
C81  ValueDisplayed: 22uF  [1206_180]  (hidden comment: GCM31CR71A226KE02)
C82  ValueDisplayed: 22uF  [1206_180]  (hidden comment: GCM31CR71A226KE02)
C86  ValueDisplayed: 390pF  [0402L]  (hidden comment: CGA2B2NP01H391J050BA)
C87  ValueDisplayed: 390pF  [0402L]  (hidden comment: CGA2B2NP01H391J050BA)
C88  ValueDisplayed: 390pF  [0402L]  (hidden comment: CGA2B2NP01H391J050BA)
C89  ValueDisplayed: 390pF  [0402L]  (hidden comment: CGA2B2NP01H391J050BA)
L1  ValueDisplayed: 470nH  [DFE252012P]  (hidden comment: DFE252012P-R47M=P2)
L2  ValueDisplayed: 470nH  [DFE252012P]  (hidden comment: DFE252012P-R47M=P2)
L3  ValueDisplayed: 470nH  [DFE252012P]  (hidden comment: DFE252012P-R47M=P2)
L4  ValueDisplayed: 470nH  [DFE252012P]  (hidden comment: DFE252012P-R47M=P2)
R138  ValueDisplayed: 100k  [0402L]  (hidden comment: CRCW0402100KFKED)
R139  ValueDisplayed: 1.96k  [0402L]  (hidden comment: CRCW04021K96FKED)
R141  ValueDisplayed: 0  [0402L]  (hidden comment: ERJ-2GE0R00X)
R142  ValueDisplayed: 4.99k  [0402L]  (hidden comment: ERJ-2RKF4991X)
R143  ValueDisplayed: 4.99k  [0402L]  (hidden comment: CRCW04024K99FKED)
R144  ValueDisplayed: 0  [0201_Silk]  (hidden comment: CRCW02010000Z0ED)
R145  ValueDisplayed: 10.0k  [0402L]  (hidden comment: CRCW040210K0FKED)
R146  ValueDisplayed: 0  [0201_Silk]  (hidden comment: CRCW02010000Z0ED)
R147  ValueDisplayed: 4.99k  [0402L]  (hidden comment: CRCW04024K99FKED)
R148  ValueDisplayed: 10.0k  [0402L]  (hidden comment: CRCW040210K0FKED)
R149  ValueDisplayed: 1.0k  [0402L]  (hidden comment: ERJ-2GEJ102X)
R150  ValueDisplayed: 4.99k  [0402L]  (hidden comment: ERJ-2RKF4991X)
R190  ValueDisplayed: 3.83  [0402L]  (hidden comment: CRCW04023R83FKED)
R191  ValueDisplayed: 3.83  [0402L]  (hidden comment: CRCW04023R83FKED)
R192  ValueDisplayed: 3.83  [0402L]  (hidden comment: CRCW04023R83FKED)
R193  ValueDisplayed: 3.83  [0402L]  (hidden comment: CRCW04023R83FKED)
U8  LP87524JRNFRQ1  [RNF0026C]

### Ports
AR_SCL, AR_SDA, PGOOD, PMIC_CLK, PMIC_EN1, PMIC_EN2, PMIC_EN3, PMIC_NRST

### Nets
5V_IN: R149.2
5V_UNREG: C59.2 C60.2 C68.2 C72.2 C73.2 U8.9(VIN_B0) U8.13(VIN_B1) U8.18(VANA) U8.22(VIN_B3) U8.26(VIN_B2)
GND: C54.1 C55.1 C59.1 C60.1 C68.1 C72.1 C73.1 C81.1 C82.1 C86.1 C87.1 C88.1 C89.1 R138.1 R139.1 U8.4(AGND) U8.11(PGND_B01) U8.17(AGND) U8.24(PGND_B23) U8.27(AGND)
PMIC_1V0: C81.2 L4.2 U8.1(FB_B2)
PMIC_1V2: C54.2 L1.2 U8.14(FB_B1)
PMIC_1V8: C82.2 L3.2 U8.21(FB_B3)
PMICOUT_3V3: C55.2 L2.2 R141.1 U8.8(FB_B0)
PMICVIO_3V3: R139.2 R142.2 R143.2 R145.2 R147.2 R148.2 R149.1 R150.1
AR_SCL: R144.1 ; port AR_SCL
AR_SDA: R146.2 ; port AR_SDA
PGOOD: R138.2 R141.2 ; port PGOOD
PMIC_CLK: U8.3(CLKIN) ; port PMIC_CLK
PMIC_EN1: R142.1 U8.7(EN1) ; port PMIC_EN1
PMIC_EN2: R148.1 U8.15(EN2) ; port PMIC_EN2
PMIC_EN3: R145.1 U8.2(EN3) ; port PMIC_EN3
PMIC_NRST: R150.2 U8.20(~{RST}) ; port PMIC_NRST
SW0: L2.1 R190.2 U8.10(SW_B0)
SW1: L1.1 R191.2 U8.12(SW_B1)
SW2: L4.1 R192.2 U8.25(SW_B2)
SW3: L3.1 R193.2 U8.23(SW_B3)
NetC86_2: C86.2 R190.1
NetC87_2: C87.2 R191.1
NetC88_2: C88.2 R192.1
NetC89_2: C89.2 R193.1
NetR143_1: R143.1 U8.16(PGOOD)
NetR144_2: R144.2 U8.5(SCL)
NetR146_1: R146.1 U8.6(SDA)
NetR147_1: R147.1 U8.19(~{INT})

### Layout directives
net class PWR: PGOOD, PMIC_1V0, PMIC_1V2, PMIC_1V8, PMICOUT_3V3, PMICVIO_3V3
net class GENERAL: (no net found under the mark), NetR143_1, PMIC_NRST, SW0, SW1, SW2, SW3
net class CLK: PMIC_CLK

### Notes on the sheet
- PMIC (3.3V, 1.2V, 1.8V,2.3V OUTPUTS) REFERENCE
- SNUBBER ON SWITCHING NODES
- CONTROLS FOR THE PMIC
- THE 3V3 OUTPUT FROM PMIC IS USED AS PGOOD.
- Drawn By:
- SVN Rev:
- Number:
- TID #:
- Orderable:
- Rev:
- Sheet Title:
- File:
- Project Title:
- Designed for:
- Assembly Variant:
- Mod. Date:
- Sheet:
- Size:
- of
- B
- http://www.ti.com
- Texas Instruments and/or its licensors do not warrant the accuracy or completeness of this specification or any information contained therein. Texas Instruments and/or its licensors do not warrant that this design will meet the specifications, will be suitable for your application or fit for any particular purpose, or will operate in an implementation. Texas Instruments and/or its licensors do not warrant that the design is production worthy. You should completely validate and test your design implementation to confirm the system functionality for your application.
- Engineer:
- Contact:
- © Texas Instruments

### Library data of the parts
C54 = CMP-0008811-2: CAP, CERM, 22 uF, 10 V, +/- 10%, X7R, AEC-Q200 Grade 1, 1206; Manufacturer: MuRata; TaMin_C: -55°C; Polarized: N; SizeAreaWB_mm2: 10.92; Value1: Unknown; U/M: EA; Value: 22uF; TaMax_C: 125°C; SizeZ_mm: 1.8; SizeX_mm: 3.2; SizeY_mm: 1.6; Cap_Case: 1206; Value2: 10V; SizeArea_mm2: 5.12; CompType: Capacitor; AEC Qualified: Y; Cap_F: 22µF; AEC Grade: 1; AEC Category: Q200; Publisher: Texas Instruments; TempCo: X7R; Published: 2008-06-19; RoHS: Y; MountType: SMT; PackageReference: 1206; Tolerance_%: 10%; LatestRevisionDate: 2017-03-09; PartNumber: GCM31CR71A226KE02; VDC_V: 10V; ComponentLink1Description: Datasheet link; Technology: Ceramic; ComponentLink1URL: http://psearch.en.murata.com/capacitor/product/GCM31CR71A226KE02%23.pdf
C55 C81 C82 = CMP-0008811-2: CAP, CERM, 22 uF, 10 V, +/- 10%, X7R, AEC-Q200 Grade 1, 1206; Manufacturer: MuRata; TaMin_C: -55°C; Polarized: N; SizeAreaWB_mm2: 10.92; Value1: Unknown; U/M: EA; Value: 22uF; TaMax_C: 125°C; SizeZ_mm: 1.8; SizeX_mm: 3.2; SizeY_mm: 1.6; Cap_Case: 1206; Value2: 10V; SizeArea_mm2: 5.12; AEC Qualified: Y; Cap_F: 22µF; AEC Grade: 1; AEC Category: Q200; Publisher: Texas Instruments; TempCo: X7R; Published: 2008-06-19; RoHS: Y; MountType: SMT; PackageReference: 1206; Tolerance_%: 10%; CompType: Capacitor; LatestRevisionDate: 2017-03-09; PartNumber: GCM31CR71A226KE02; VDC_V: 10V; ComponentLink1Description: Datasheet link; Technology: Ceramic; ComponentLink1URL: http://psearch.en.murata.com/capacitor/product/GCM31CR71A226KE02%23.pdf
C59 C60 C72 C73 = CMP-0008017-2: as C45 on sheet PROC010B_Decoupling_Caps_Reference; Supplier Part Number 2: 06AC6014; Publisher: Texas Instruments; Supplier 2: Newark; Supplier Part Number 3: 81-GCM21BR71A106KE2L; TempCo: X7R; Supplier 3: Mouser; Published: 2008-06-19; RoHS: Y; MountType: SMT; Supplier 1: Digi-Key; PackageReference: 0805; Tolerance_%: 10%; LatestRevisionDate: 2017-03-09; PartNumber: GCM21BR71A106KE22L; AEC Qualified: ?; VDC_V: 10V; ComponentLink1Description: Datasheet link; Supplier Part Number 1: 490-10674-1-ND; Technology: Ceramic; ComponentLink1URL: http://www.murata.com/products/catalog/pdf/c03e.pdf
C68 = CMP-0078265-1: as C3 on sheet PROC010B_Decoupling_Caps_Reference; ComponentLink1URL: http://psearch.en.murata.com/capacitor/product/GCM155R71C224KE02%23.pdf; Supplier Part Number 2: 81-GCM155R71C224KE2D; Supplier 2: Mouser; TempCo: X7R; RoHS: Y; MountType: SMT; Supplier 1: Digi-Key; PackageReference: 0402; Tolerance_%: 10%; SizeArea_mm2: 0.5; PartNumber: GCM155R71C224KE02D; VDC_V: 16V; ComponentLink1Description: Datasheet link; AEC Grade: 1; Supplier Part Number 1: 490-10671-1-ND; Technology: Ceramic
C86-C89 = CMP-0078223-1: CAP, CERM, 390 pF, 50 V,+/- 5%, C0G/NP0, AEC-Q200 Grade 0, 0402; Manufacturer: TDK; TaMin_C: -55°C; Polarized: N; SizeAreaWB_mm2: 3; U/M: EA; Value: 390pF; TaMax_C: 150°C; SizeZ_mm: 0.6; SizeX_mm: 1; SizeY_mm: 0.5; Cap_Case: 0402; Value2: 50V; AEC Qualified: Y; AEC Grade: 0; AEC Category: Q200; ComponentLink1URL: https://product.tdk.com/info/en/catalog/datasheets/mlcc_automotive_hightemp_en.pdf; Supplier Part Number 2: 810-CGA2B2NP01H391JA; Supplier 2: Mouser; TempCo: C0G/NP0; RoHS: Y; MountType: SMT; Supplier 1: Digi-Key; PackageReference: 0402; Tolerance_%: 5%; SizeArea_mm2: 0.5; CompType: Capacitor; PartNumber: CGA2B2NP01H391J050BA; Cap_F: 390pF; VDC_V: 50V; ComponentLink1Description: Datasheet link; Supplier Part Number 1: 445-12137-1-ND; Technology: Ceramic
L1-L4 = CMP-0058946-1: Inductor, Shielded, 470 nH, 4.7 A, 0.021 ohm, SMD; Manufacturer: MuRata Toko; Isat: 6.4A @ 30% inductance drop; Irms: 4.7A @ 40C rise; SizeAreaWB_mm2: 10.5; DCR_ohm: 0.021; Value: 470nH; Imax_A: 4.7A; SizeZ_mm: 1.2; SizeX_mm: 2.5; SizeY_mm: 2; SizeArea_mm2: 5; AEC Category: Q200; ComponentLink1URL: http://www.toko.co.jp/products/pdf/inductors/dfe252012p.pdf; Publisher: Texas Instruments; Published: 2008-06-26; RoHS: Y; Value1: 0.021 ohm; Material: ?; MountType: SMT; PackageReference: 1008; Value2: 4.7A; CompType: Inductor; Ind_H: 470nH; LatestRevisionDate: 2017-06-02; PartNumber: DFE252012P-R47M=P2; AEC Qualified: ?; ComponentLink1Description: Datasheet link; Technology: Shielded
R138 = CMP-0025950-3: RES, 100 k, 1%, 0.063 W, AEC-Q200 Grade 0, 0402; Manufacturer: Vishay-Dale; Power_W: 63mW; TempCo: 100 ppm/C; Value: 100k; EIA_Code: E96; SizeX_mm: 1; SizeY_mm: 0.5; SizeZ_mm: 0.6; Value2: 0.063W; AEC Qualified: Y; VDC_V: 50V; AEC Category: Q200; AEC Grade: 0; Supplier Part Number 2: 52K6607; Supplier 2: Newark; Supplier Part Number 3: 71-CRCW0402-100K-E3; Supplier 3: Mouser; Value_Code: 100k; RoHS: E; Value1: 1%; MountType: SMT; Supplier 1: Digi-Key; PackageReference: 0402; Tolerance_%: 1%; Res_ohm: 100k; SizeArea_mm2: 0.5; CompType: Resistor; PartNumber: CRCW0402100KFKED; ComponentLink1Description: Datasheet link; Supplier Part Number 1: 541-100KLCT-ND; Technology: Thick Film; ComponentLink1URL: http://www.vishay.com/docs/20035/dcrcwe3.pdf
R139 = CMP-0026099-2: RES, 1.96 k, 1%, 0.063 W, AEC-Q200 Grade 0, 0402; Manufacturer: Vishay-Dale; Power_W: 63mW; TempCo: 100 ppm/C; Value_Code: 1k96; Value: 1.96k; EIA_Code: E96; SizeX_mm: 1; SizeY_mm: 0.5; SizeZ_mm: 0.6; Value2: 0.063W; AEC Qualified: Y; VDC_V: 50V; AEC Category: Q200; AEC Grade: 0; ComponentLink1URL: http://www.vishay.com/docs/20035/dcrcwe3.pdf; Supplier Part Number 2: 52K6592; Supplier 2: Newark; Supplier Part Number 3: 71-CRCW0402-1.96K-E3; Supplier 3: Mouser; RoHS: E; Value1: 1%; MountType: SMT; Supplier 1: Digi-Key; PackageReference: 0402; Tolerance_%: 1%; Res_ohm: 1.96k; SizeArea_mm2: 0.5; CompType: Resistor; PartNumber: CRCW04021K96FKED; ComponentLink1Description: Datasheet link; Supplier Part Number 1: 541-1.96KLCT-ND; Technology: Thick Film
R141 = CMP-0026992-2: RES, 0, 5%, 0.063 W, 0402; Manufacturer: Panasonic; Power_W: 63mW; TempCo: 600 ppm/C; Value_Code: 0000; U/M: EA; Value: 0; EIA_Code: E24; SizeX_mm: 1; SizeY_mm: 0.5; SizeZ_mm: 0.6; Value2: 0.063W; VDC_V: 50V; AEC Category: Q200; Supplier Part Number 2: 65T8307; Publisher: Texas Instruments; Supplier 2: Newark; Supplier Part Number 3: 667-ERJ-2GE0R00X; Supplier 3: Mouser; Published: 2008-06-26; RoHS: Y; Value1: 5%; MountType: SMT; Supplier 1: Digi-Key; PackageReference: 0402; Tolerance_%: 5%; Res_ohm: 0; SizeArea_mm2: 0.5; CompType: Resistor; LatestRevisionDate: 2017-03-09; PartNumber: ERJ-2GE0R00X; AEC Qualified: ?; ComponentLink1Description: Datasheet link; Supplier Part Number 1: P0.0JCT-ND; Technology: Thick Film; ComponentLink1URL: http://www.panasonic.com/industrial/components/pdf/AOA0000CE1.pdf
R142 R150 = CMP-0026701-1: RES, 4.99 k, 1%, 0.1 W, AEC-Q200 Grade 0, 0402; Manufacturer: Panasonic; Power_W: 100mW; TempCo: 100 ppm/C; Value_Code: 4k99; U/M: EA; Value: 4.99k; EIA_Code: E96; SizeX_mm: 1; SizeY_mm: 0.5; SizeZ_mm: 0.6; Value2: 0.1W; AEC Qualified: Y; VDC_V: 50V; AEC Grade: 0; AEC Category: Q200; ComponentLink1URL: http://industrial.panasonic.com/cdbs/www-data/pdf/RDA0000/AOA0000C86.pdf; Supplier Part Number 2: 73T6529; Publisher: Texas Instruments; Supplier 2: Newark; Supplier Part Number 3: 667-ERJ-2RKF4991X; Supplier 3: Mouser; Published: 2008-06-26; RoHS: Y; Value1: 1%; MountType: SMT; Supplier 1: Digi-Key; PackageReference: 0402; Tolerance_%: 1%; Res_ohm: 4.99k; SizeArea_mm2: 0.5; CompType: Resistor; LatestRevisionDate: 2017-03-09; PartNumber: ERJ-2RKF4991X; ComponentLink1Description: Datasheet link; Supplier Part Number 1: P4.99KLCT-ND; Technology: Thick Film
R143 R147 = CMP-0026414-2: RES, 4.99 k, 1%, 0.063 W, AEC-Q200 Grade 0, 0402; Manufacturer: Vishay-Dale; Power_W: 63mW; TempCo: 100 ppm/C; Value_Code: 4k99; Value: 4.99k; EIA_Code: E96; SizeX_mm: 1; SizeY_mm: 0.5; SizeZ_mm: 0.6; Value2: 0.063W; AEC Qualified: Y; VDC_V: 50V; AEC Category: Q200; AEC Grade: 0; ComponentLink1URL: http://www.vishay.com/docs/20035/dcrcwe3.pdf; Supplier Part Number 2: 52K7048; Supplier 2: Newark; Supplier Part Number 3: 71-CRCW0402-4.99K-E3; Supplier 3: Mouser; RoHS: E; Value1: 1%; MountType: SMT; Supplier 1: Digi-Key; PackageReference: 0402; Tolerance_%: 1%; Res_ohm: 4.99k; SizeArea_mm2: 0.5; CompType: Resistor; PartNumber: CRCW04024K99FKED; ComponentLink1Description: Datasheet link; Supplier Part Number 1: 541-4.99KLCT-ND; Technology: Thick Film
R144 R146 = CMP-0027008-4: as R197 on sheet PROC010B_DUT_Reference; RoHS: E; Value1: 5%; MountType: SMT; Supplier 1: Newark; PackageReference: 0201; Tolerance_%: 5%; Res_ohm: 0; CompType: Resistor; PartNumber: CRCW02010000Z0ED; ComponentLink1Description: Datasheet link; AEC Grade: N/A; Supplier Part Number 1: 72M6743; Technology: Thick Film; ComponentLink1URL: http://www.vishay.com/docs/20052/crcw0201e3.pdf
R145 = CMP-0025958-3: as R196 on sheet PROC010B_DUT_Reference; Supplier Part Number 2: 52K6595; Supplier 2: Newark; Supplier Part Number 3: 71-CRCW0402-10K-E3; Supplier 3: Mouser; RoHS: E; Value1: 1%; MountType: SMT; Supplier 1: Digi-Key; PackageReference: 0402; Tolerance_%: 1%; SizeArea_mm2: 0.5; PartNumber: CRCW040210K0FKED; ComponentLink1Description: Datasheet link; Supplier Part Number 1: 541-10.0KLCT-ND; Technology: Thick Film; ComponentLink1URL: http://www.vishay.com/docs/20035/dcrcwe3.pdf
R148 = CMP-0025958-3: as R13 on sheet PROC010B_DUT_Reference; Supplier Part Number 2: 52K6595; Supplier 2: Newark; Supplier Part Number 3: 71-CRCW0402-10K-E3; Supplier 3: Mouser; RoHS: E; Value1: 1%; MountType: SMT; Supplier 1: Digi-Key; PackageReference: 0402; Tolerance_%: 1%; SizeArea_mm2: 0.5; CompType: Resistor; PartNumber: CRCW040210K0FKED; ComponentLink1Description: Datasheet link; Supplier Part Number 1: 541-10.0KLCT-ND; Technology: Thick Film; ComponentLink1URL: http://www.vishay.com/docs/20035/dcrcwe3.pdf
R149 = CMP-0078193-1: RES, 1.0 k, 5%, 0.1 W, AEC-Q200 Grade 0, 0402; Manufacturer: Panasonic; Value_Code: 1k00; SizeArea_mm2: 0.5; AEC Qualified: Y; AEC Category: Q200; Res_ohm: 1k; Value: 1.0k; SizeZ_mm: 0.6; Green_REACh: Passed; EIA_Code: E24; TempCo: 200 ppm/C; AEC Grade: 0; Power_W: 100mW; VDC_V: 50V; Value2: 0.1W; Green_Lifecycle: Active; U/M: EA; SizeX_mm: 1; ComponentLink1Description: Datasheet link; RoHS: Y; Supplier Part Number 3: 667-ERJ-2GEJ102X; Tolerance_%: 5%; Supplier 1: Digi-Key; Green_EU RoHS: Passed with Exemption; PackageReference: 0402; Technology: Thick Film; PartNumber: ERJ-2GEJ102X; Supplier Part Number 2: 65T8247; Supplier 2: Newark; SizeY_mm: 0.5; ComponentLink1URL: https://industrial.panasonic.com/cdbs/www-data/pdf/RDA0000/DMA0000COL9.pdf; Value1: 5%; CompType: Resistor; MountType: SMT; Supplier Part Number 1: P1.0KJCT-ND; Supplier 3: Mouser; Green_EU RoHS-2: Passed
R190-R193 = CMP-0026363-2: RES, 3.83, 1%, 0.063 W, AEC-Q200 Grade 0, 0402; Manufacturer: Vishay-Dale; Power_W: 63mW; TempCo: 100 ppm/C; Value_Code: 3R83; Value: 3.83; EIA_Code: E96; SizeX_mm: 1; SizeY_mm: 0.5; SizeZ_mm: 0.6; Value2: 0.063W; AEC Qualified: Y; VDC_V: 50V; AEC Category: Q200; AEC Grade: 0; ComponentLink1URL: http://www.vishay.com/docs/20035/dcrcwe3.pdf; Supplier Part Number 2: 71-CRCW04023R83FKED; Supplier 2: Mouser; RoHS: E; Value1: 1%; MountType: SMT; Supplier 1: Digi-Key; PackageReference: 0402; Tolerance_%: 1%; Res_ohm: 3.83; SizeArea_mm2: 0.5; CompType: Resistor; PartNumber: CRCW04023R83FKED; ComponentLink1Description: Datasheet link; Supplier Part Number 1: 541-3.83LLCT-ND; Technology: Thick Film
U8 = CMP-0079120-1: 4-A + 2.5-A + Two 1.5-A Buck Converters With Integrated Switches, RNF0026C (VQFN-HR-26); Alternate PartNumber: LP87524JRNFTQ1; Alternate Manufacturer: Texas Instruments; SizeAreaWB_mm2: 27.5; SizeZ_mm: 0.9; SizeX_mm: 4; SizeY_mm: 4.5; SizeArea_mm2: 18; CompType: IC; AEC Qualified: Y; AEC Category: Q200; ComponentLink1URL: http://www.ti.com/lit/ds/symlink/lp87524-q1.pdf; PackageDescription: VQFN-HR-26; RoHS: Y; MountType: SMT; ComponentLink2URL: http://www.ti.com/product/lp87524-q1; ComponentLink2Description: Product Folder; Manufacturer: Texas Instruments; PackageReference: RNF0026C; PartNumber: LP87524JRNFRQ1; ComponentLink1Description: Datasheet Link